# EAGLE design display_e7 (EAGLE 7.7.0)

## Sheet 1 of 8: Atmega8
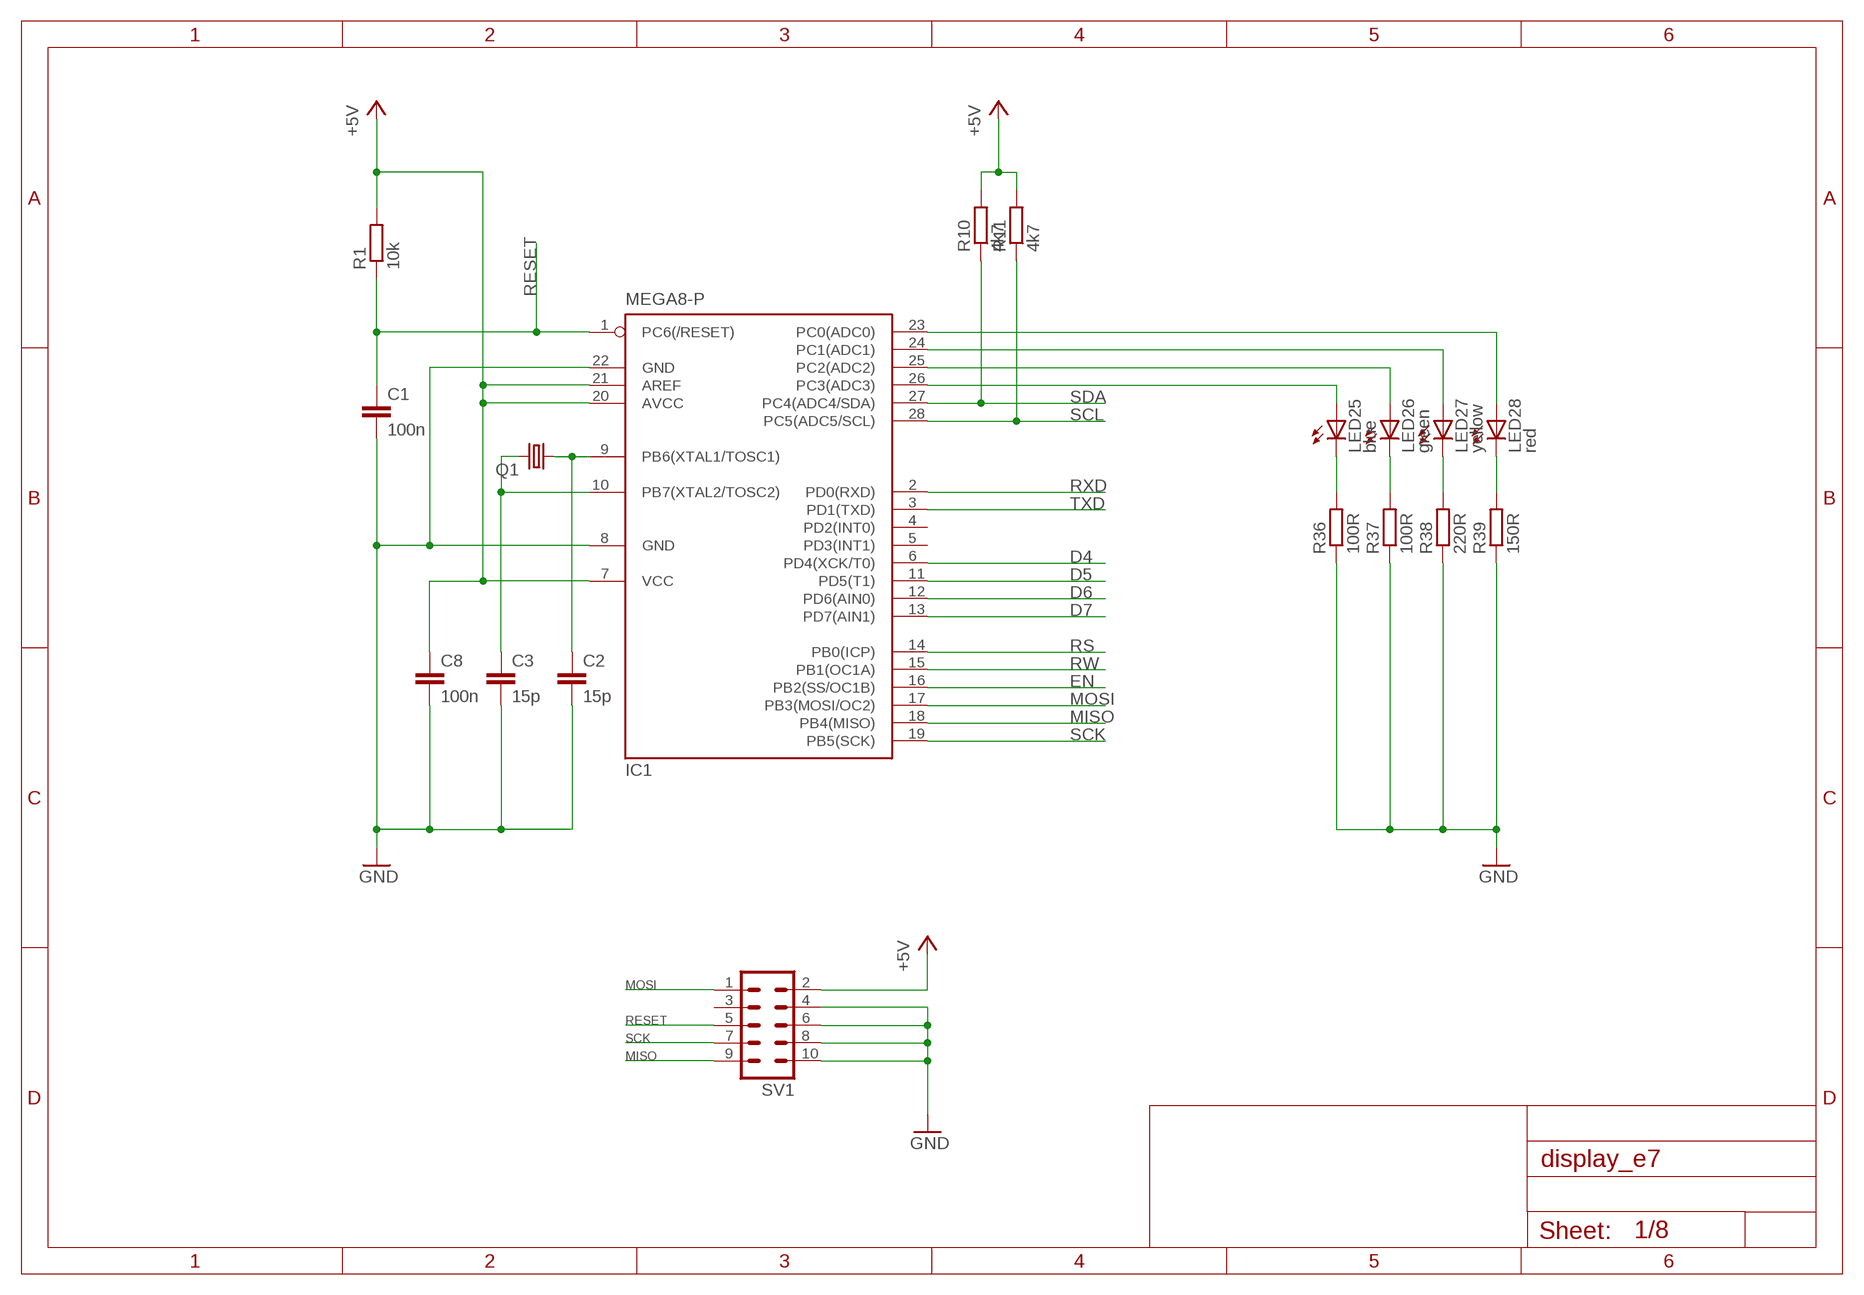
[diagram p0: schematic, sheet 1]

### Parts
C1  100n  C-EU025-025X050  [C025-025X050]
C2  15p  C-EU025-025X050  [C025-025X050]
C3  15p  C-EU025-025X050  [C025-025X050]
C8  100n  C-EU025-025X050  [C025-025X050]
IC1  MEGA8-P  [DIL28-3]
LED25  blue  LED3MM  [LED3MM]
LED26  green  LED3MM  [LED3MM]
LED27  yellow  LED3MM  [LED3MM]
LED28  red  LED3MM  [LED3MM]
Q1  CRYSTALHC49U-V  [HC49U-V]
R1  10k  R-EU_0207/10  [0207/10]
R10  4k7  R-EU_0207/10  [0207/10]
R11  4k7  R-EU_0207/10  [0207/10]
R36  100R  R-EU_0207/10  [0207/10]
R37  100R  R-EU_0207/10  [0207/10]
R38  220R  R-EU_0207/10  [0207/10]
R39  150R  R-EU_0207/10  [0207/10]
SV1  ML10  [ML10]

### Nets
+5V: C8.1 IC1.7(VCC) IC1.20(AVCC) IC1.21(AREF) R1.2 R10.2 R11.2 SV1.2 ; also sheet 2,3,4,5,6,7
D4: IC1.6(PD4(XCK/T0)) ; also sheet 2
D5: IC1.11(PD5(T1)) ; also sheet 2
D6: IC1.12(PD6(AIN0)) ; also sheet 2
D7: IC1.13(PD7(AIN1)) ; also sheet 2
EN: IC1.16(PB2(SS/OC1B)) ; also sheet 2
GND: C1.2 C2.2 C3.2 C8.2 IC1.8(GND) IC1.22(GND) R36.1 R37.1 R38.1 R39.1 SV1.4 SV1.6 SV1.8 SV1.10 ; also sheet 2,3,4,5,6,7
MISO: IC1.18(PB4(MISO)) SV1.9
MOSI: IC1.17(PB3(MOSI/OC2)) SV1.1
N$2: C2.1 IC1.9(PB6(XTAL1/TOSC1)) Q1.1
N$3: C3.1 IC1.10(PB7(XTAL2/TOSC2)) Q1.2
N$40: IC1.23(PC0(ADC0)) LED28.A
N$41: IC1.24(PC1(ADC1)) LED27.A
N$42: IC1.25(PC2(ADC2)) LED26.A
N$43: IC1.26(PC3(ADC3)) LED25.A
N$44: LED28.K(C) R39.2
N$45: LED27.K(C) R38.2
N$46: LED26.K(C) R37.2
N$47: LED25.K(C) R36.2
RESET: C1.1 IC1.1(PC6(/RESET)) R1.1 SV1.5
RS: IC1.14(PB0(ICP)) ; also sheet 2
RW: IC1.15(PB1(OC1A)) ; also sheet 2
RXD: IC1.2(PD0(RXD)) ; also sheet 4
SCK: IC1.19(PB5(SCK)) SV1.7
SCL: IC1.28(PC5(ADC5/SCL)) R11.1 ; also sheet 7
SDA: IC1.27(PC4(ADC4/SDA)) R10.1 ; also sheet 7
TXD: IC1.3(PD1(TXD)) ; also sheet 4
Unconnected: IC1.4(PD2(INT0)) IC1.5(PD3(INT1)) SV1.3

## Sheet 2 of 8: Display
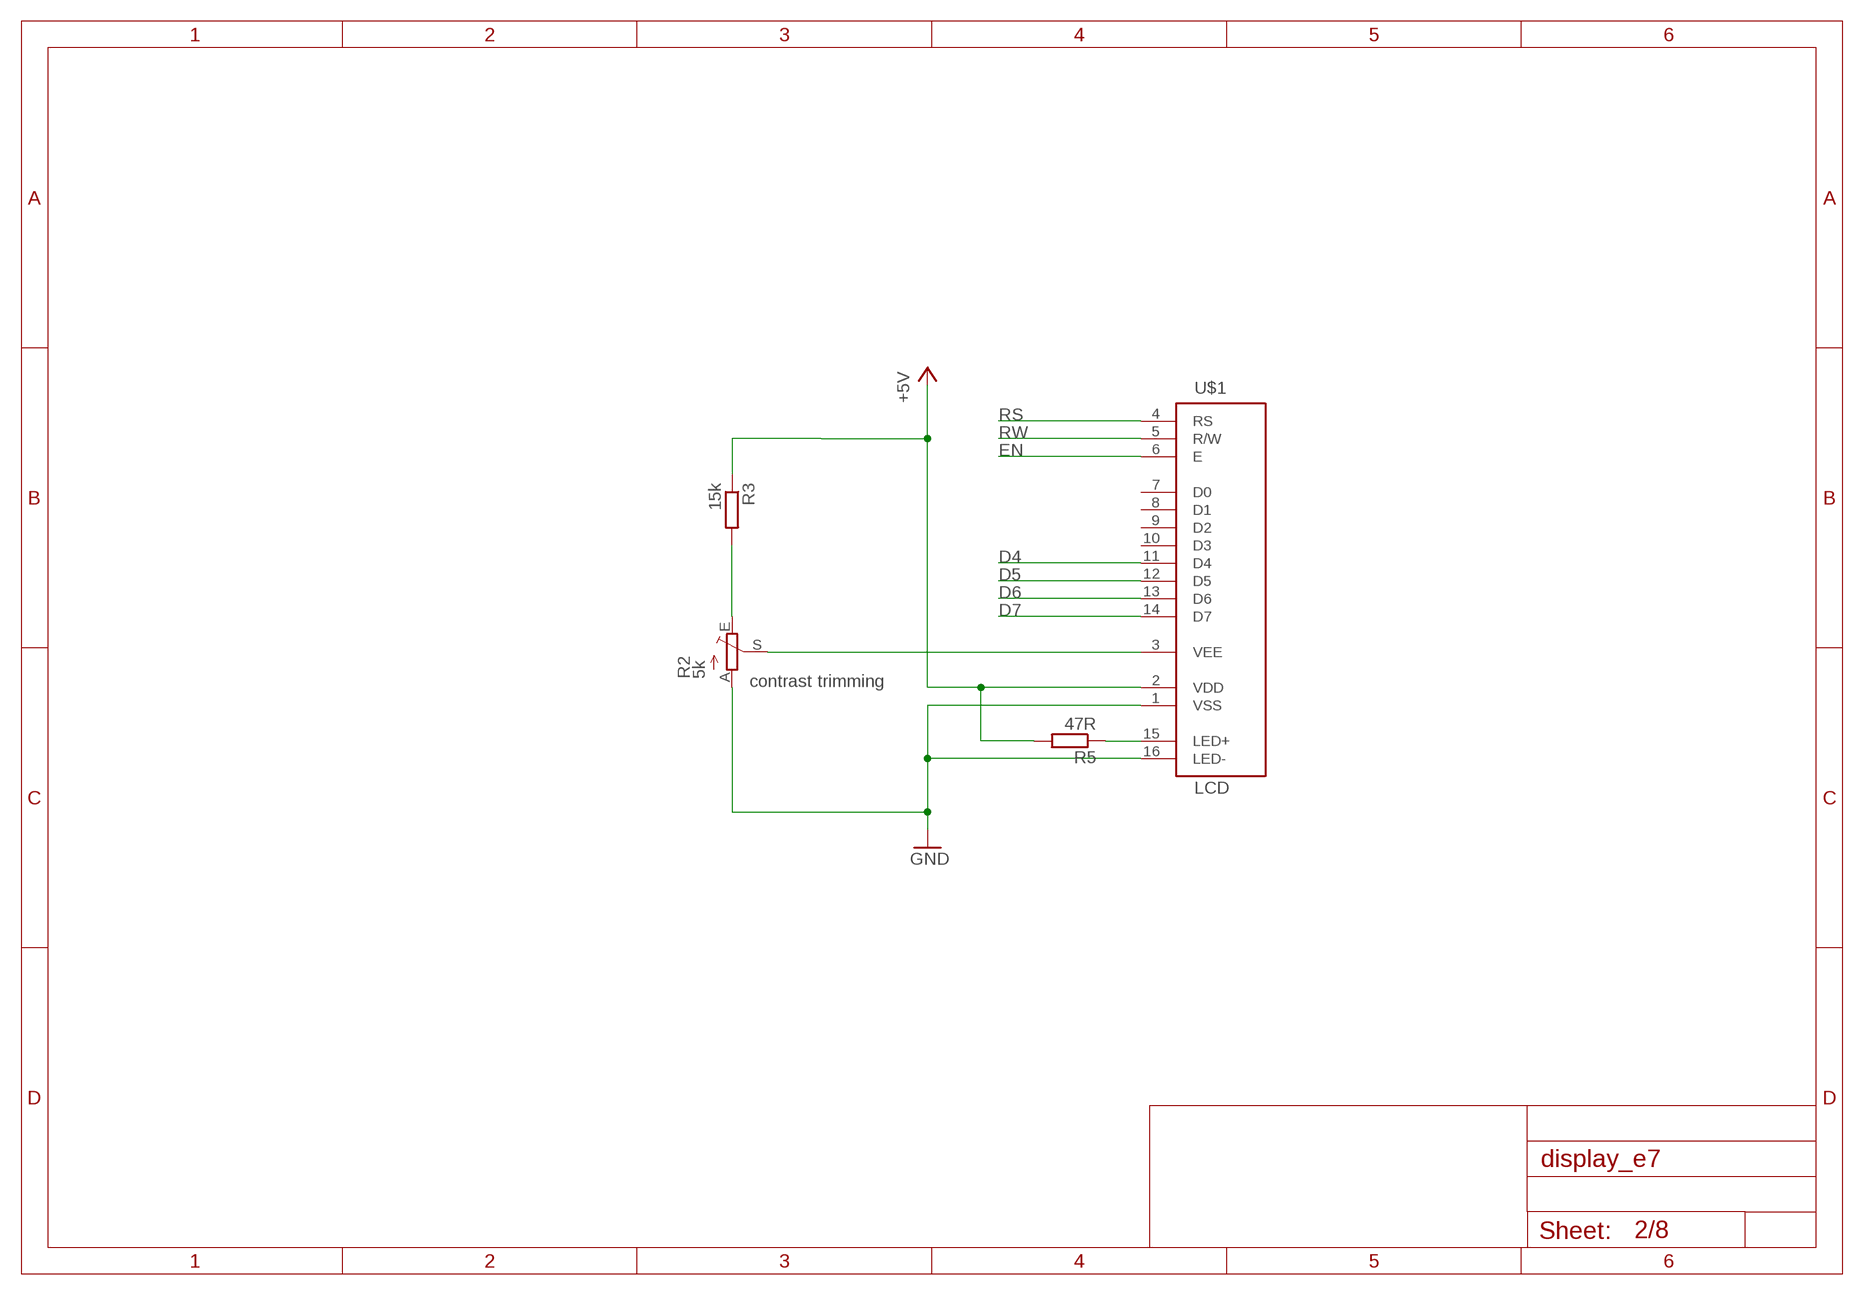
[diagram p1: schematic, sheet 2]

### Parts
R2  5k  TRIM_EU-PT10  [PT-10]
R3  15k  R-EU_0207/10  [0207/10]
R5  47R  R-EU_0207/10  [0207/10]
U$1  LCD  [LCD]

### Nets
+5V: R3.1 R5.2 U$1.2(VDD) ; also sheet 1,3,4,5,6,7
D4: U$1.11(D4) ; also sheet 1
D5: U$1.12(D5) ; also sheet 1
D6: U$1.13(D6) ; also sheet 1
D7: U$1.14(D7) ; also sheet 1
EN: U$1.6(E) ; also sheet 1
GND: R2.A U$1.1(VSS) U$1.16(LED-) ; also sheet 1,3,4,5,6,7
N$9: R2.E R3.2
N$10: R2.S U$1.3(VEE)
N$11: R5.1 U$1.15(LED+)
RS: U$1.4(RS) ; also sheet 1
RW: U$1.5(R/W) ; also sheet 1
Unconnected: U$1.7(D0) U$1.8(D1) U$1.9(D2) U$1.10(D3)

### Notes on the sheet
- contrast trimming

## Sheet 3 of 8: Connectors
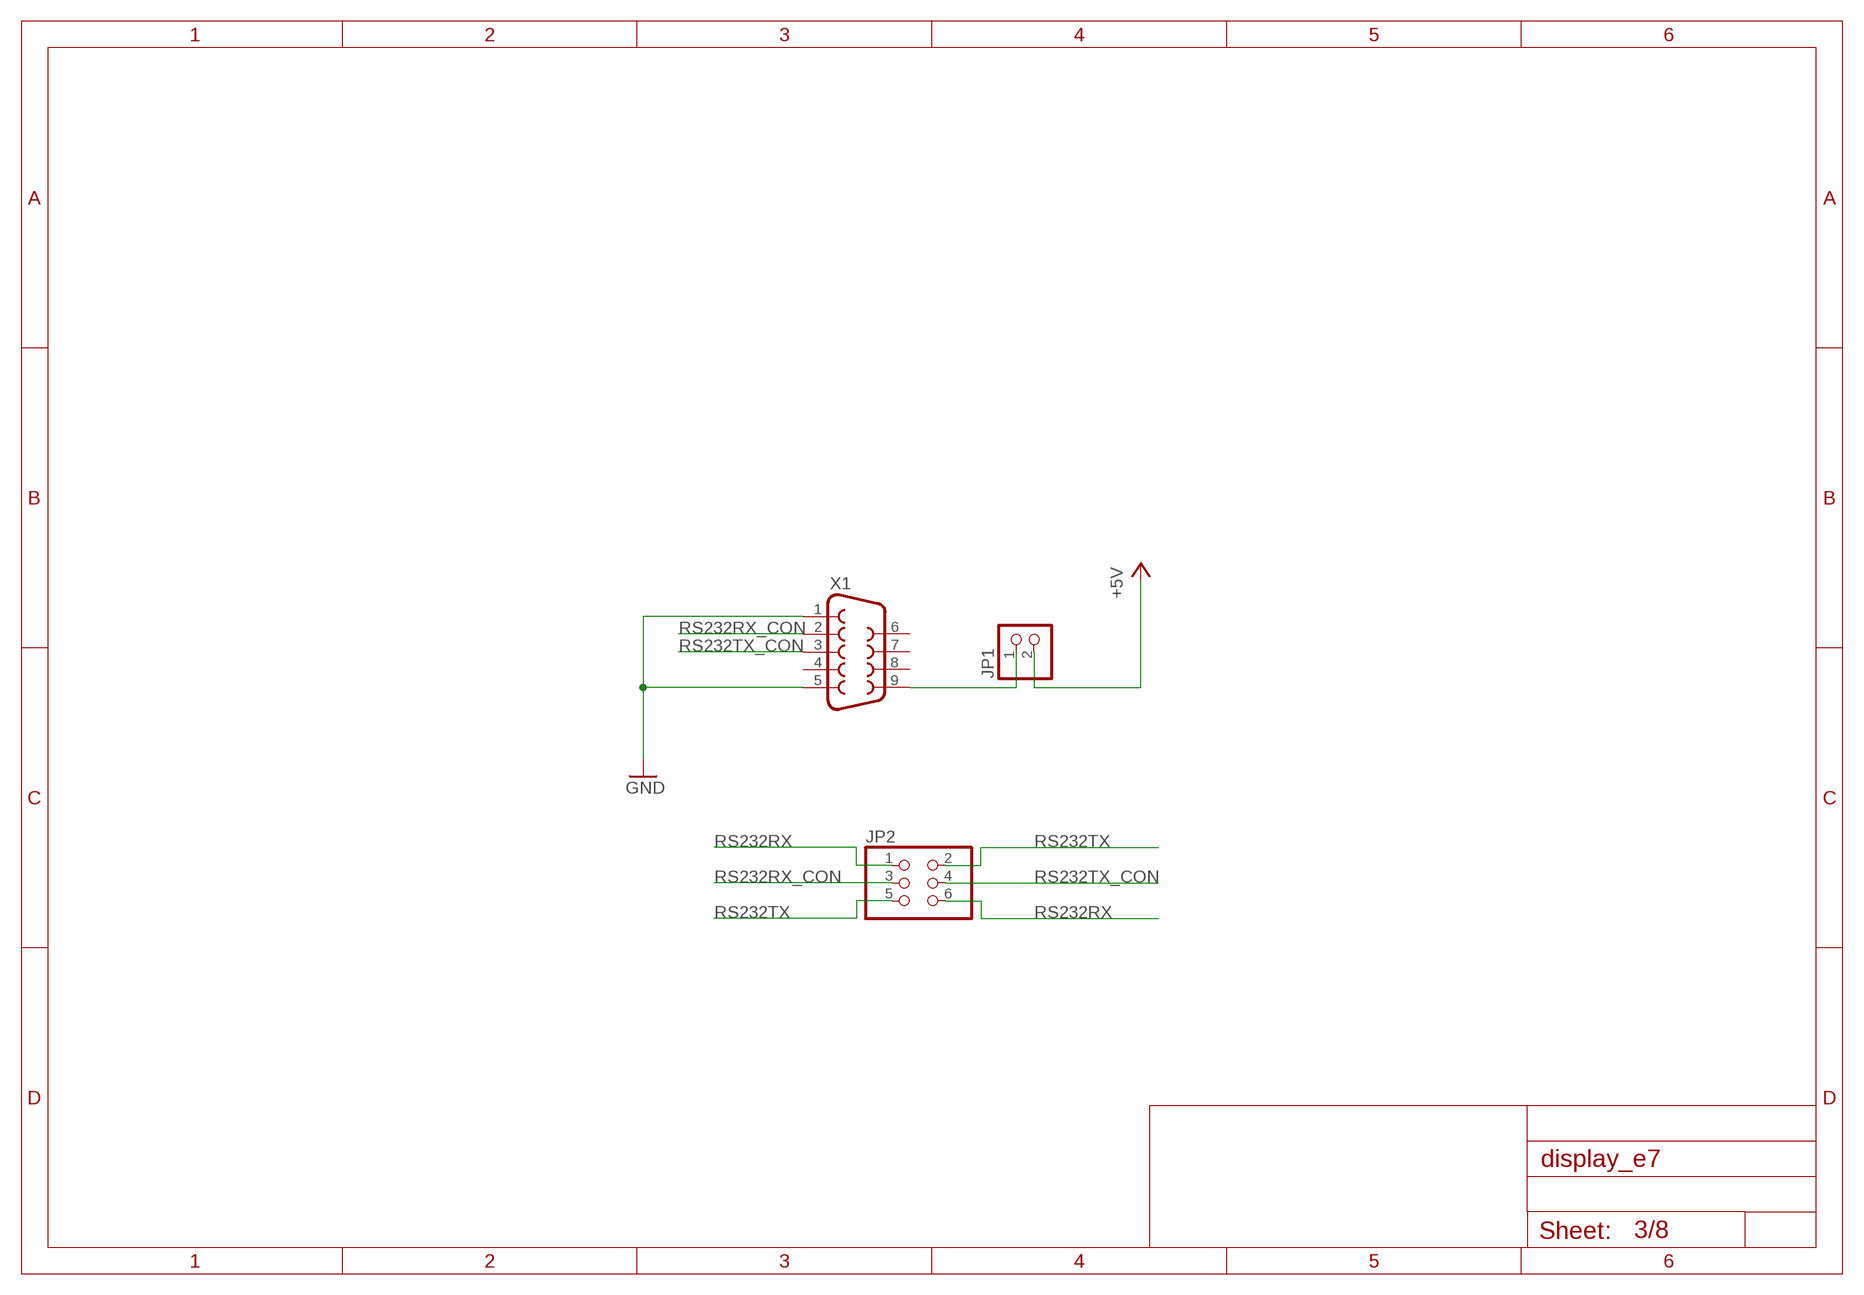
[diagram p2: schematic, sheet 3]

### Parts
JP1  PINHD-1X2  [1X02]
JP2  PINHD-2X3  [2X03]
X1  F09HP  [F09HP]

### Nets
+5V: JP1.2 ; also sheet 1,2,4,5,6,7
GND: X1.1 X1.5 ; also sheet 1,2,4,5,6,7
N$48: JP1.1 X1.9
RS232RX: JP2.1 JP2.6 ; also sheet 4
RS232RX_CON: JP2.3 X1.2
RS232TX: JP2.2 JP2.5 ; also sheet 4
RS232TX_CON: JP2.4 X1.3
Unconnected: X1.4 X1.6 X1.7 X1.8

## Sheet 4 of 8: RS232
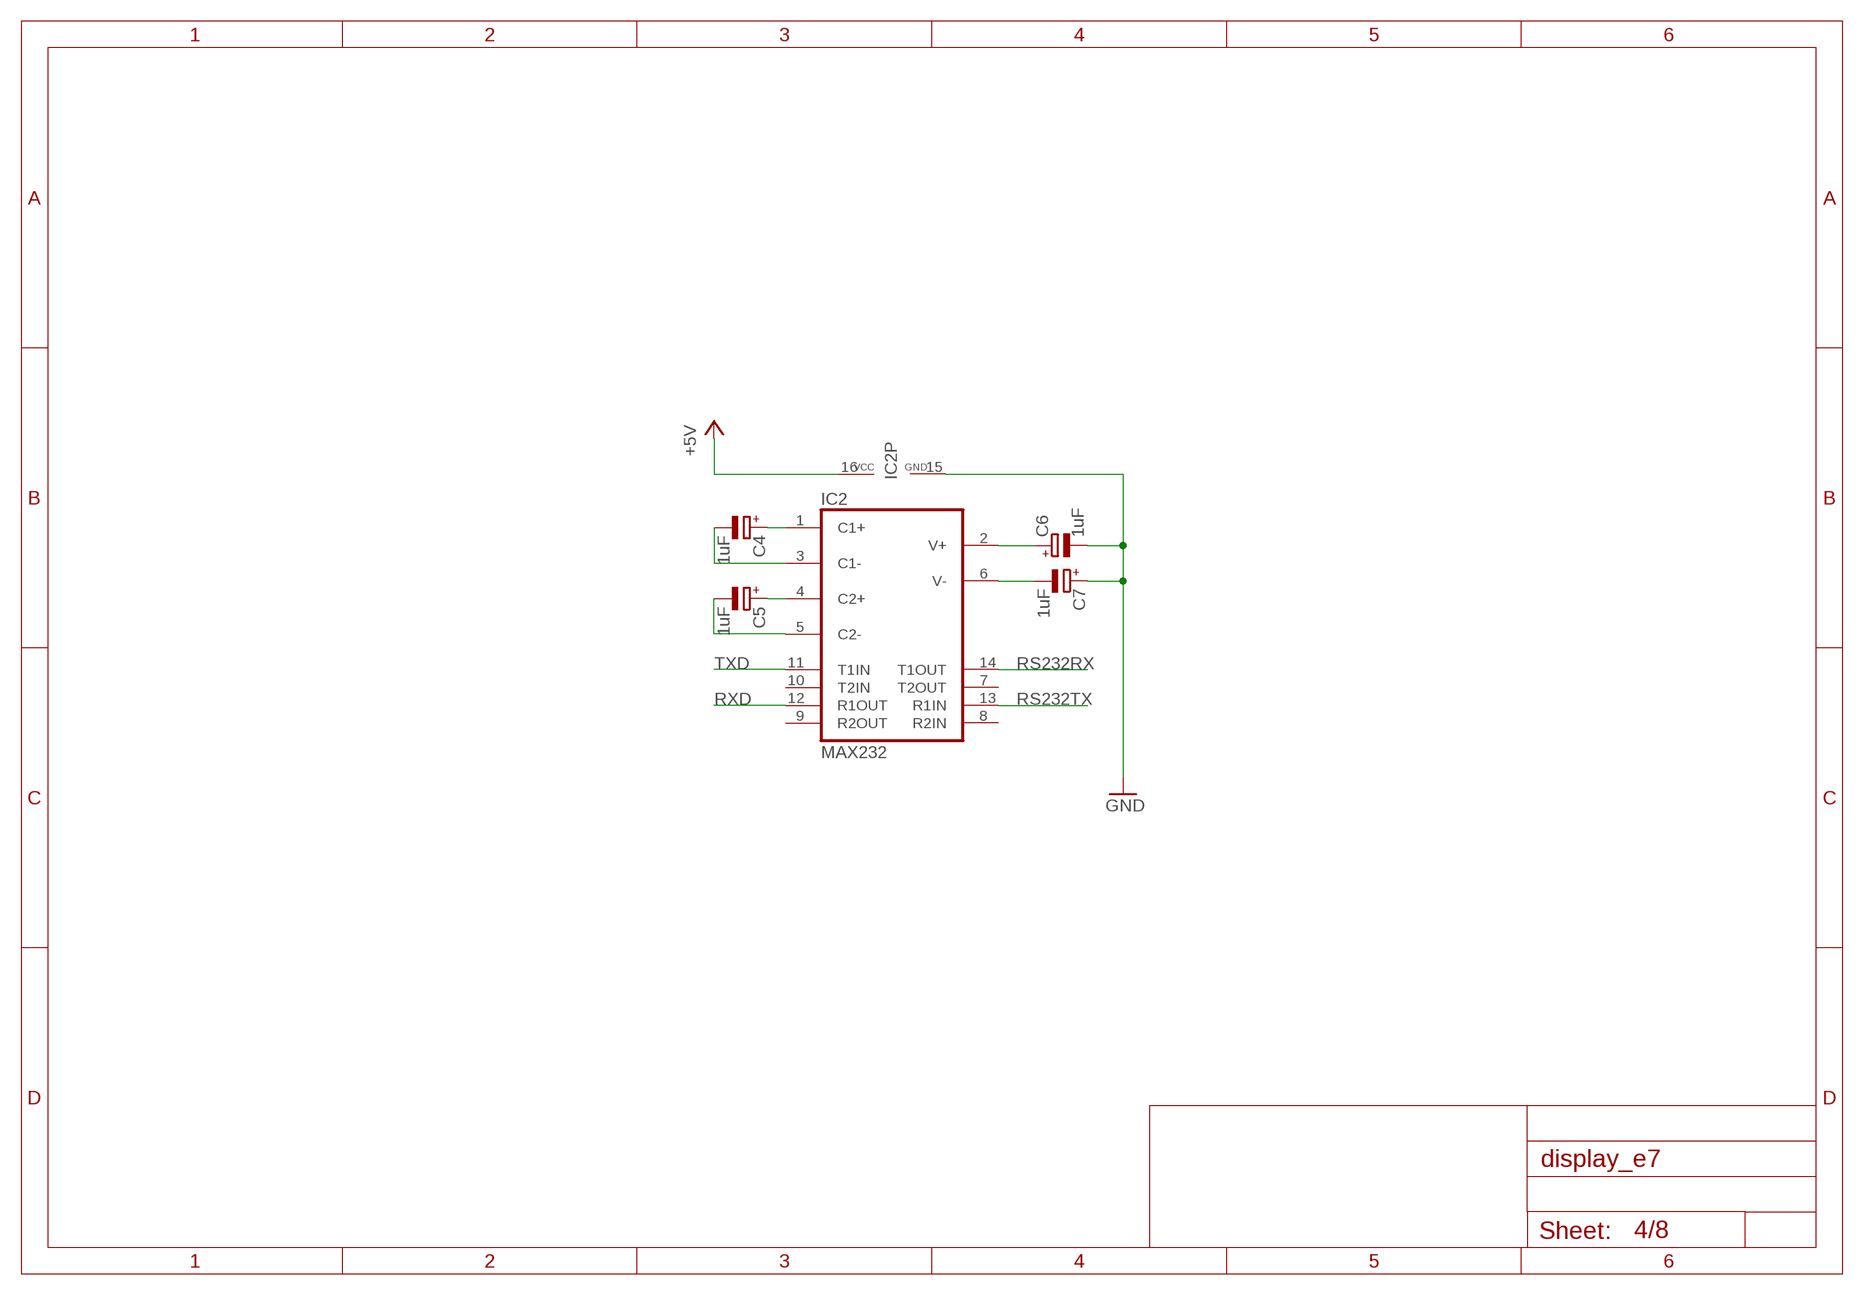
[diagram p3: schematic, sheet 4]

### Parts
C4  1uF  CPOL-EUE2.5-5  [E2,5-5]
C5  1uF  CPOL-EUE2.5-5  [E2,5-5]
C6  1uF  CPOL-EUE2.5-5  [E2,5-5]
C7  1uF  CPOL-EUE2.5-5  [E2,5-5]
IC2  MAX232  [DIL16]

### Nets
+5V: IC2.16(VCC) ; also sheet 1,2,3,5,6,7
GND: C6.- C7.+ IC2.15(GND) ; also sheet 1,2,3,5,6,7
N$1: C4.+ IC2.1(C1+)
N$4: C5.+ IC2.4(C2+)
N$5: C5.- IC2.5(C2-)
N$6: C4.- IC2.3(C1-)
N$7: C6.+ IC2.2(V+)
N$8: C7.- IC2.6(V-)
RS232RX: IC2.14(T1OUT) ; also sheet 3
RS232TX: IC2.13(R1IN) ; also sheet 3
RXD: IC2.12(R1OUT) ; also sheet 1
TXD: IC2.11(T1IN) ; also sheet 1
Unconnected: IC2.7(T2OUT) IC2.8(R2IN) IC2.9(R2OUT) IC2.10(T2IN)

## Sheet 5 of 8: LED Bar
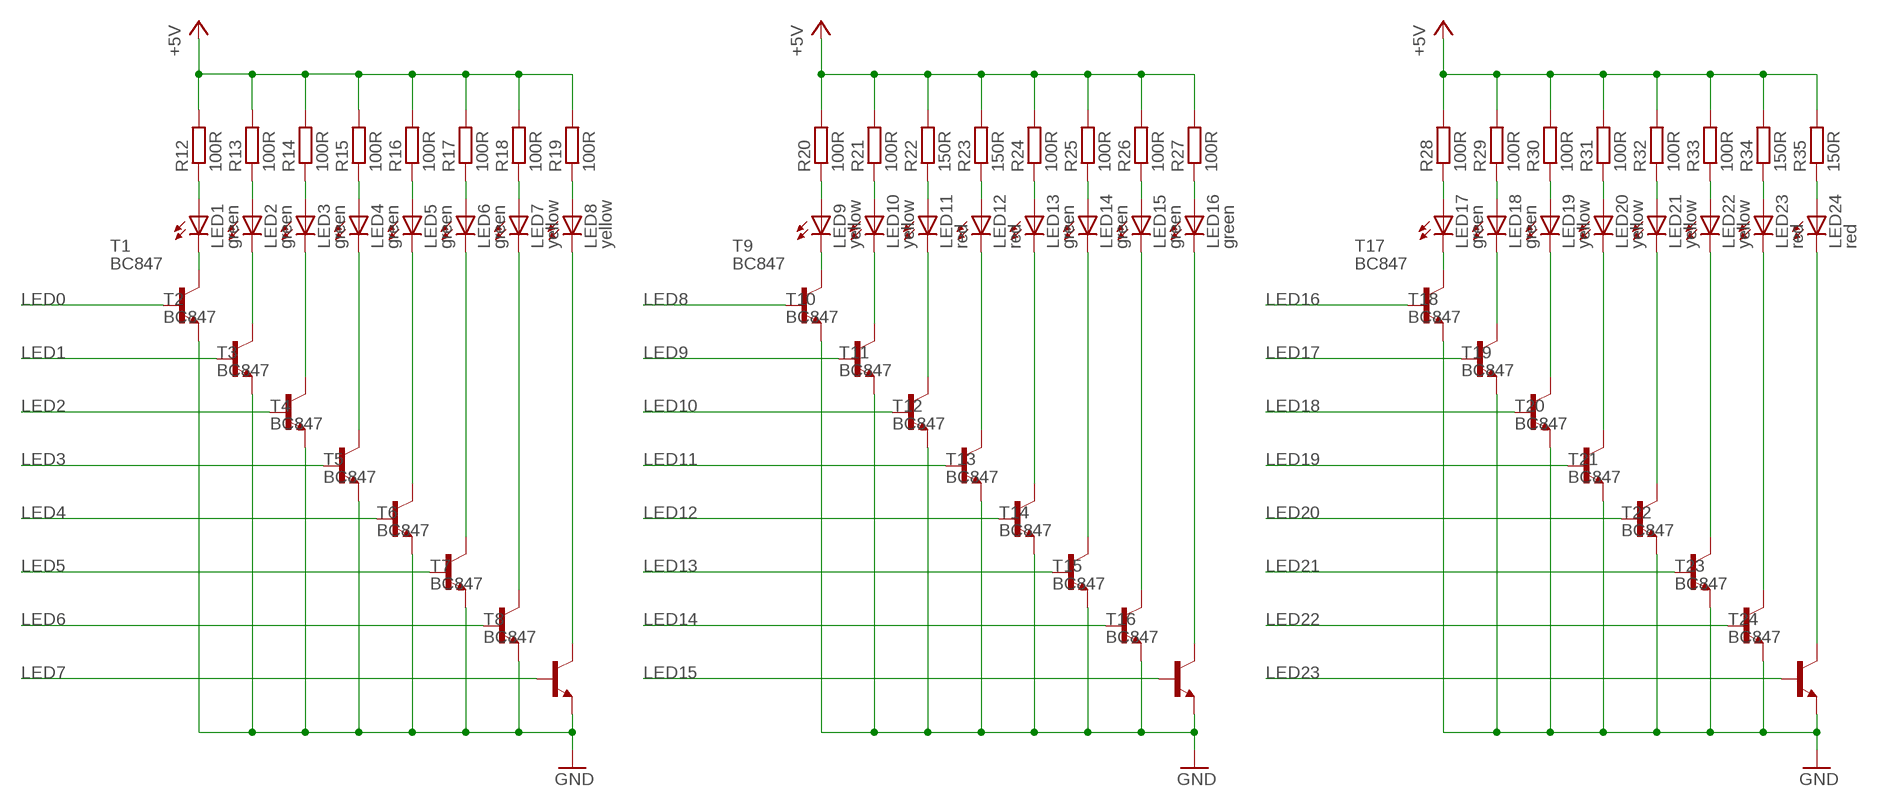
[diagram p4: schematic, sheet 5]

### Parts
LED1  green  LED5MM  [LED5MM]
LED2  green  LED5MM  [LED5MM]
LED3  green  LED5MM  [LED5MM]
LED4  green  LED5MM  [LED5MM]
LED5  green  LED5MM  [LED5MM]
LED6  green  LED5MM  [LED5MM]
LED7  yellow  LED5MM  [LED5MM]
LED8  yellow  LED5MM  [LED5MM]
LED9  yellow  LED5MM  [LED5MM]
LED10  yellow  LED5MM  [LED5MM]
LED11  red  LED5MM  [LED5MM]
LED12  red  LED5MM  [LED5MM]
LED13  green  LED5MM  [LED5MM]
LED14  green  LED5MM  [LED5MM]
LED15  green  LED5MM  [LED5MM]
LED16  green  LED5MM  [LED5MM]
LED17  green  LED5MM  [LED5MM]
LED18  green  LED5MM  [LED5MM]
LED19  yellow  LED5MM  [LED5MM]
LED20  yellow  LED5MM  [LED5MM]
LED21  yellow  LED5MM  [LED5MM]
LED22  yellow  LED5MM  [LED5MM]
LED23  red  LED5MM  [LED5MM]
LED24  red  LED5MM  [LED5MM]
R12  100R  R-EU_0207/10  [0207/10]
R13  100R  R-EU_0207/10  [0207/10]
R14  100R  R-EU_0207/10  [0207/10]
R15  100R  R-EU_0207/10  [0207/10]
R16  100R  R-EU_0207/10  [0207/10]
R17  100R  R-EU_0207/10  [0207/10]
R18  100R  R-EU_0207/10  [0207/10]
R19  100R  R-EU_0207/10  [0207/10]
R20  100R  R-EU_0207/10  [0207/10]
R21  100R  R-EU_0207/10  [0207/10]
R22  150R  R-EU_0207/10  [0207/10]
R23  150R  R-EU_0207/10  [0207/10]
R24  100R  R-EU_0207/10  [0207/10]
R25  100R  R-EU_0207/10  [0207/10]
R26  100R  R-EU_0207/10  [0207/10]
R27  100R  R-EU_0207/10  [0207/10]
R28  100R  R-EU_0207/10  [0207/10]
R29  100R  R-EU_0207/10  [0207/10]
R30  100R  R-EU_0207/10  [0207/10]
R31  100R  R-EU_0207/10  [0207/10]
R32  100R  R-EU_0207/10  [0207/10]
R33  100R  R-EU_0207/10  [0207/10]
R34  150R  R-EU_0207/10  [0207/10]
R35  150R  R-EU_0207/10  [0207/10]
T1  BC847  [SOT23]
T2  BC847  [SOT23]
T3  BC847  [SOT23]
T4  BC847  [SOT23]
T5  BC847  [SOT23]
T6  BC847  [SOT23]
T7  BC847  [SOT23]
T8  BC847  [SOT23]
T9  BC847  [SOT23]
T10  BC847  [SOT23]
T11  BC847  [SOT23]
T12  BC847  [SOT23]
T13  BC847  [SOT23]
T14  BC847  [SOT23]
T15  BC847  [SOT23]
T16  BC847  [SOT23]
T17  BC847  [SOT23]
T18  BC847  [SOT23]
T19  BC847  [SOT23]
T20  BC847  [SOT23]
T21  BC847  [SOT23]
T22  BC847  [SOT23]
T23  BC847  [SOT23]
T24  BC847  [SOT23]

### Nets
+5V: R12.2 R13.2 R14.2 R15.2 R16.2 R17.2 R18.2 R19.2 R20.2 R21.2 R22.2 R23.2 R24.2 R25.2 R26.2 R27.2 R28.2 R29.2 R30.2 R31.2 R32.2 R33.2 R34.2 R35.2 ; also sheet 1,2,3,4,6,7
GND: T1.2(E) T2.2(E) T3.2(E) T4.2(E) T5.2(E) T6.2(E) T7.2(E) T8.2(E) T9.2(E) T10.2(E) T11.2(E) T12.2(E) T13.2(E) T14.2(E) T15.2(E) T16.2(E) T17.2(E) T18.2(E) T19.2(E) T20.2(E) T21.2(E) T22.2(E) T23.2(E) T24.2(E) ; also sheet 1,2,3,4,6,7
LED0: T1.1(B) ; also sheet 7
LED1: T2.1(B) ; also sheet 7
LED2: T3.1(B) ; also sheet 7
LED3: T4.1(B) ; also sheet 7
LED4: T5.1(B) ; also sheet 7
LED5: T6.1(B) ; also sheet 7
LED6: T7.1(B) ; also sheet 7
LED7: T8.1(B) ; also sheet 7
LED8: T9.1(B) ; also sheet 7
LED9: T10.1(B) ; also sheet 7
LED10: T11.1(B) ; also sheet 7
LED11: T12.1(B) ; also sheet 7
LED12: T13.1(B) ; also sheet 7
LED13: T14.1(B) ; also sheet 7
LED14: T15.1(B) ; also sheet 7
LED15: T16.1(B) ; also sheet 7
LED16: T17.1(B) ; also sheet 7
LED17: T18.1(B) ; also sheet 7
LED18: T19.1(B) ; also sheet 7
LED19: T20.1(B) ; also sheet 7
LED20: T21.1(B) ; also sheet 7
LED21: T22.1(B) ; also sheet 7
LED22: T23.1(B) ; also sheet 7
LED23: T24.1(B) ; also sheet 7
N$15: LED1.A R12.1
N$17: LED2.A R13.1
N$18: LED3.A R14.1
N$19: LED4.A R15.1
N$20: LED5.A R16.1
N$21: LED6.A R17.1
N$22: LED7.A R18.1
N$23: LED8.A R19.1
N$24: LED9.A R20.1
N$25: LED10.A R21.1
N$26: LED11.A R22.1
N$27: LED12.A R23.1
N$28: LED13.A R24.1
N$29: LED14.A R25.1
N$30: LED15.A R26.1
N$31: LED16.A R27.1
N$32: LED17.A R28.1
N$33: LED18.A R29.1
N$34: LED19.A R30.1
N$35: LED20.A R31.1
N$36: LED21.A R32.1
N$37: LED22.A R33.1
N$38: LED23.A R34.1
N$39: LED24.A R35.1
N$51: LED9.K(C) T9.3(C)
N$53: LED1.K(C) T1.3(C)
N$54: LED2.K(C) T2.3(C)
N$55: LED3.K(C) T3.3(C)
N$56: LED4.K(C) T4.3(C)
N$57: LED5.K(C) T5.3(C)
N$58: LED6.K(C) T6.3(C)
N$59: LED17.K(C) T17.3(C)
N$60: LED10.K(C) T10.3(C)
N$61: LED11.K(C) T11.3(C)
N$62: LED12.K(C) T12.3(C)
N$63: LED13.K(C) T13.3(C)
N$64: LED14.K(C) T14.3(C)
N$65: LED7.K(C) T7.3(C)
N$66: LED8.K(C) T8.3(C)
N$67: LED15.K(C) T15.3(C)
N$68: LED16.K(C) T16.3(C)
N$69: LED18.K(C) T18.3(C)
N$70: LED19.K(C) T19.3(C)
N$71: LED20.K(C) T20.3(C)
N$72: LED21.K(C) T21.3(C)
N$73: LED22.K(C) T22.3(C)
N$74: LED23.K(C) T23.3(C)
N$75: LED24.K(C) T24.3(C)

## Sheet 6 of 8: Buttons
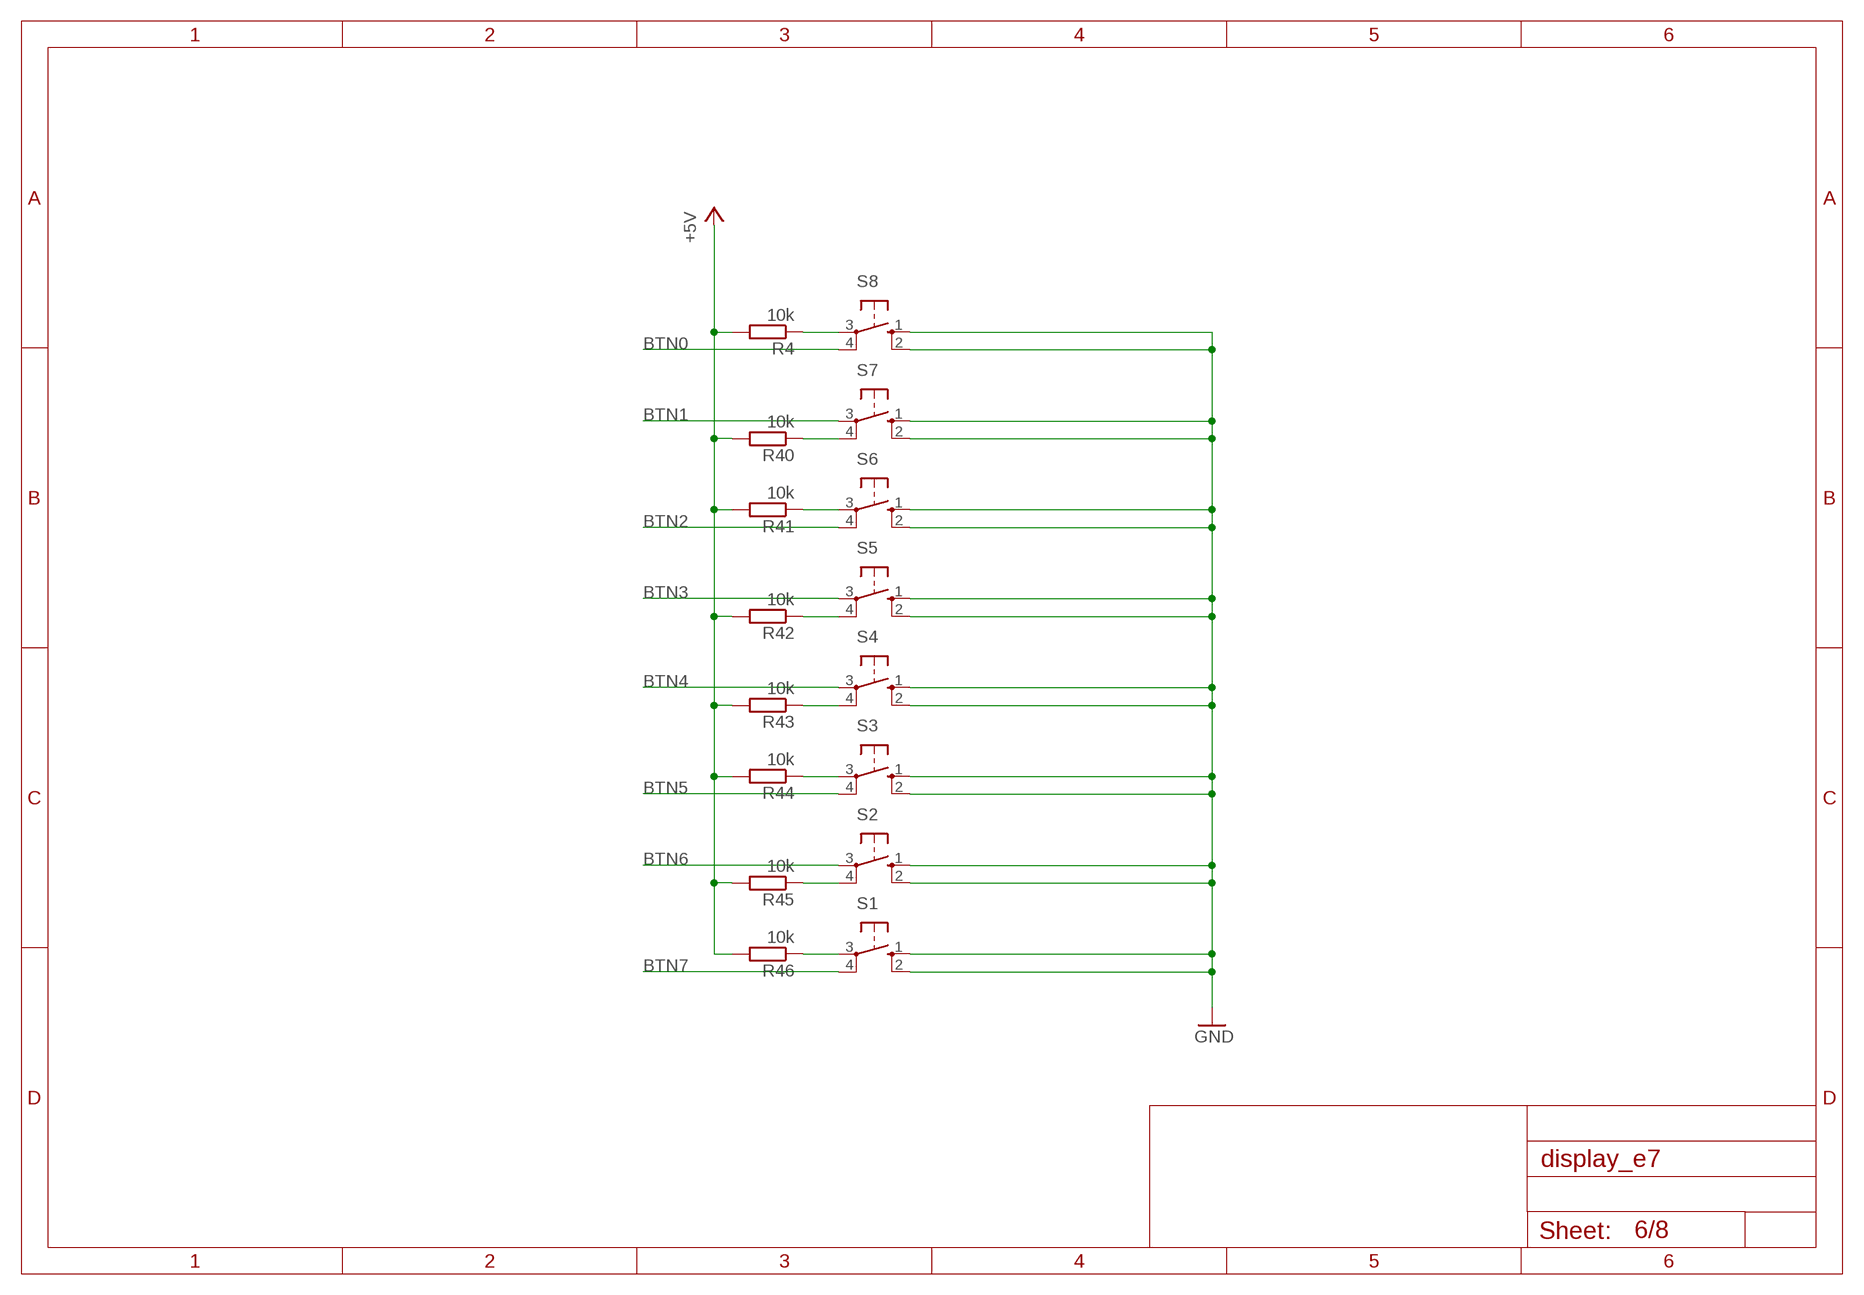
[diagram p5: schematic, sheet 6]

### Parts
R4  10k  R-EU_R0805  [R0805]
R40  10k  R-EU_R0805  [R0805]
R41  10k  R-EU_R0805  [R0805]
R42  10k  R-EU_R0805  [R0805]
R43  10k  R-EU_R0805  [R0805]
R44  10k  R-EU_R0805  [R0805]
R45  10k  R-EU_R0805  [R0805]
R46  10k  R-EU_R0805  [R0805]
S1  10-XX  [B3F-10XX]
S2  10-XX  [B3F-10XX]
S3  10-XX  [B3F-10XX]
S4  10-XX  [B3F-10XX]
S5  10-XX  [B3F-10XX]
S6  10-XX  [B3F-10XX]
S7  10-XX  [B3F-10XX]
S8  10-XX  [B3F-10XX]

### Nets
+5V: R4.2 R40.2 R41.2 R42.2 R43.2 R44.2 R45.2 R46.2 ; also sheet 1,2,3,4,5,7
BTN0: S8.4(P1) ; also sheet 7
BTN1: S7.3(P) ; also sheet 7
BTN2: S6.4(P1) ; also sheet 7
BTN3: S5.3(P) ; also sheet 7
BTN4: S4.3(P) ; also sheet 7
BTN5: S3.4(P1) ; also sheet 7
BTN6: S2.3(P) ; also sheet 7
BTN7: S1.4(P1) ; also sheet 7
GND: S1.1(S) S1.2(S1) S2.1(S) S2.2(S1) S3.1(S) S3.2(S1) S4.1(S) S4.2(S1) S5.1(S) S5.2(S1) S6.1(S) S6.2(S1) S7.1(S) S7.2(S1) S8.1(S) S8.2(S1) ; also sheet 1,2,3,4,5,7
N$49: R4.1 S8.3(P)
N$50: R41.1 S6.3(P)
N$52: R45.1 S2.4(P1)
N$76: R43.1 S4.4(P1)
N$77: R44.1 S3.3(P)
N$78: R42.1 S5.4(P1)
N$79: R46.1 S1.3(P)
N$80: R40.1 S7.4(P1)

## Sheet 7 of 8: IO Expander
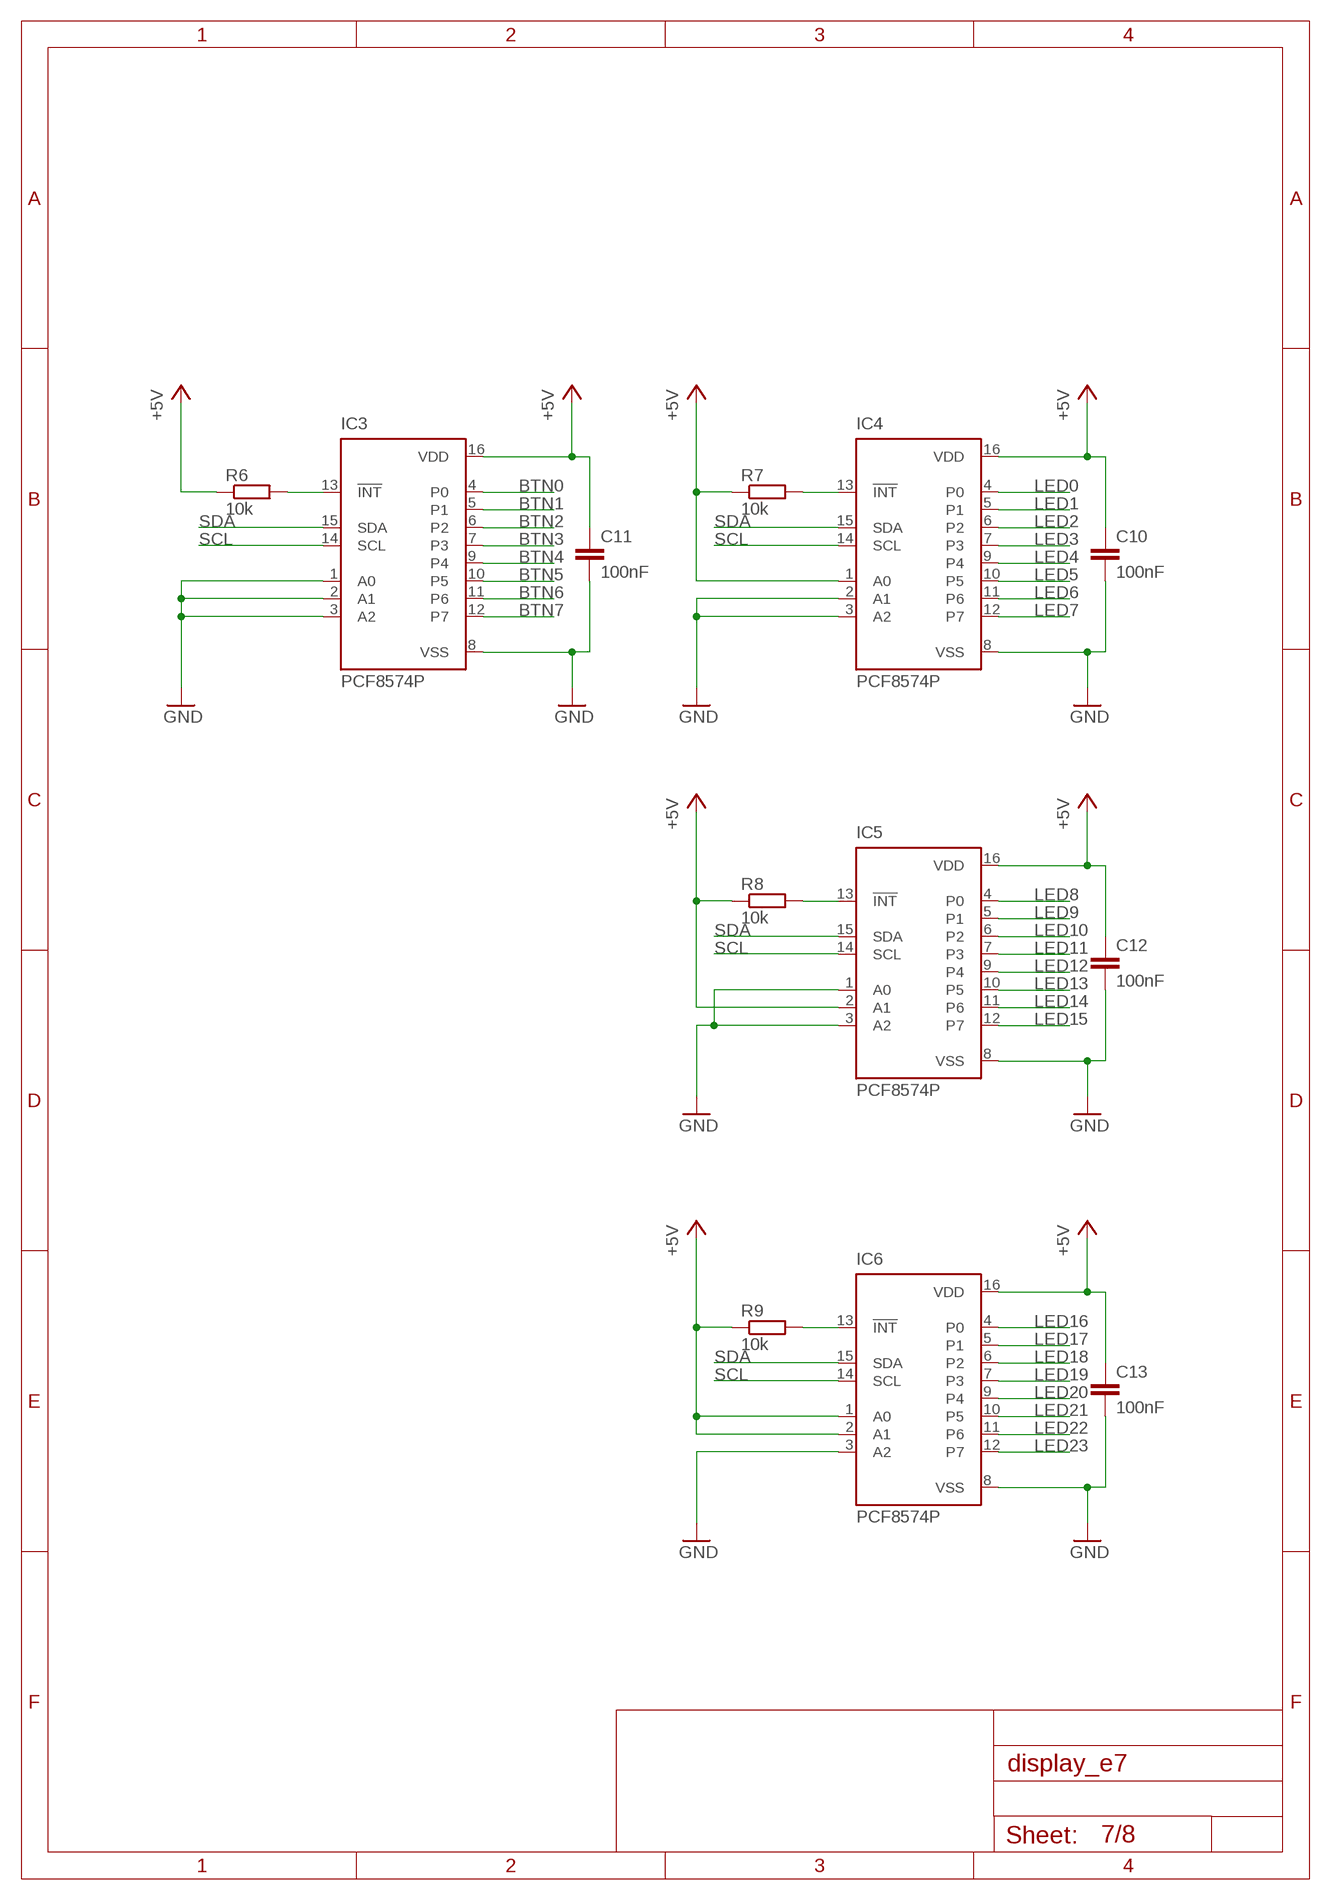
[diagram p6: schematic, sheet 7]

### Parts
C10  100nF  C-EU025-025X050  [C025-025X050]
C11  100nF  C-EU025-025X050  [C025-025X050]
C12  100nF  C-EU025-025X050  [C025-025X050]
C13  100nF  C-EU025-025X050  [C025-025X050]
IC3  PCF8574P  [DIL16]
IC4  PCF8574P  [DIL16]
IC5  PCF8574P  [DIL16]
IC6  PCF8574P  [DIL16]
R6  10k  R-EU_0207/10  [0207/10]
R7  10k  R-EU_0207/10  [0207/10]
R8  10k  R-EU_0207/10  [0207/10]
R9  10k  R-EU_0207/10  [0207/10]

### Nets
+5V: C10.1 C11.1 C12.1 C13.1 IC3.16(VDD) IC4.1(A0) IC4.16(VDD) IC5.2(A1) IC5.16(VDD) IC6.1(A0) IC6.2(A1) IC6.16(VDD) R6.1 R7.1 R8.1 R9.1 ; also sheet 1,2,3,4,5,6
BTN0: IC3.4(P0) ; also sheet 6
BTN1: IC3.5(P1) ; also sheet 6
BTN2: IC3.6(P2) ; also sheet 6
BTN3: IC3.7(P3) ; also sheet 6
BTN4: IC3.9(P4) ; also sheet 6
BTN5: IC3.10(P5) ; also sheet 6
BTN6: IC3.11(P6) ; also sheet 6
BTN7: IC3.12(P7) ; also sheet 6
GND: C10.2 C11.2 C12.2 C13.2 IC3.1(A0) IC3.2(A1) IC3.3(A2) IC3.8(VSS) IC4.2(A1) IC4.3(A2) IC4.8(VSS) IC5.1(A0) IC5.3(A2) IC5.8(VSS) IC6.3(A2) IC6.8(VSS) ; also sheet 1,2,3,4,5,6
LED0: IC4.4(P0) ; also sheet 5
LED1: IC4.5(P1) ; also sheet 5
LED2: IC4.6(P2) ; also sheet 5
LED3: IC4.7(P3) ; also sheet 5
LED4: IC4.9(P4) ; also sheet 5
LED5: IC4.10(P5) ; also sheet 5
LED6: IC4.11(P6) ; also sheet 5
LED7: IC4.12(P7) ; also sheet 5
LED8: IC5.4(P0) ; also sheet 5
LED9: IC5.5(P1) ; also sheet 5
LED10: IC5.6(P2) ; also sheet 5
LED11: IC5.7(P3) ; also sheet 5
LED12: IC5.9(P4) ; also sheet 5
LED13: IC5.10(P5) ; also sheet 5
LED14: IC5.11(P6) ; also sheet 5
LED15: IC5.12(P7) ; also sheet 5
LED16: IC6.4(P0) ; also sheet 5
LED17: IC6.5(P1) ; also sheet 5
LED18: IC6.6(P2) ; also sheet 5
LED19: IC6.7(P3) ; also sheet 5
LED20: IC6.9(P4) ; also sheet 5
LED21: IC6.10(P5) ; also sheet 5
LED22: IC6.11(P6) ; also sheet 5
LED23: IC6.12(P7) ; also sheet 5
N$12: IC3.13(!INT) R6.2
N$13: IC4.13(!INT) R7.2
N$14: IC5.13(!INT) R8.2
N$16: IC6.13(!INT) R9.2
SCL: IC3.14(SCL) IC4.14(SCL) IC5.14(SCL) IC6.14(SCL) ; also sheet 1
SDA: IC3.15(SDA) IC4.15(SDA) IC5.15(SDA) IC6.15(SDA) ; also sheet 1

## Sheet 8 of 8: PCB Dimensions
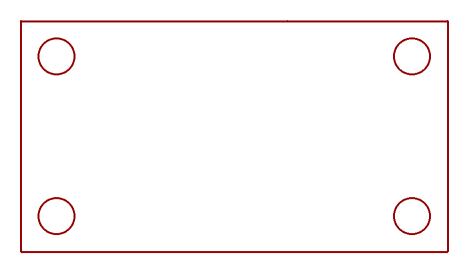
[diagram p7: schematic, sheet 8]

### Parts
U$2  DISPLAY_FRAME  [DISPLAY_FRAME]

## Library data of the parts
C1-C3 C8 C10-C13 = rcl:C-EU: CAPACITOR, European symbol; SPICEPREFIX: C
C4-C7 = rcl:CPOL-EU: POLARIZED CAPACITOR, European symbol; SPICEPREFIX: C
IC1 = atmel:MEGA8-P: MICROCONTROLLER 8 Kbytes FLASH, 1 kbytes SRAM, 512 bytes EEPROM, USART, 4-channel 10 bit ADC, 2-channel 8 bit ADC Pin compatible with Atmega48, ATMega88, ATMega168 Source: avr.lbr; OC_FARNELL: unknown; OC_NEWARK: unknown
IC2 = maxim:MAX232: RS232 TRANSCEIVER; MF: MAXIM; MPN: MAX232ACPE+; OC_FARNELL: 9723773; OC_NEWARK: 68K4544
IC3-IC6 = micro-philips:PCF8574: I2C-Bus Remote 8-bit I/O expander http://www.semiconductors.philips.com/acrobat_download/datasheets/PCF8574_4.pdf; MPN: PCF8574PN; OC_FARNELL: 204020; OC_NEWARK: 11N8515
JP1 = pinhead:PINHD-1X2: PIN HEADER
JP2 = pinhead:PINHD-2X3: PIN HEADER
LED1-LED16 LED25-LED28 = led:LED: LED OSRAM: - CHIPLED LG R971, LG N971, LY N971, LG Q971, LY Q971, LO R971, LY R971 LH N974, LH R974 LS Q976, LO Q976, LY Q976 LO Q996 - Hyper CHIPLED LW Q18S LB Q993, LB Q99A, LB R99A - SideLED LS A670, LO A670, LY A670, LG A670, LP A670 LB A673, LV A673, LT A673, LW A673 LH A674 LY A675 LS A676, LA A676, LO A676, LY A676, LW A676 LS A679, LY A679, LG A679 - Hyper Micro SIDELED® LS Y876, LA Y876, LO Y876, LY Y876 LT Y87S - SmartLED LW L88C, LW L88S LB L89C, LB L89S, LG L890 LS L89K, LO L89K, LY L89K LS L896, LA L896, LO L896, LY L896 - TOPLED LS T670, LO T670, LY T670, LG T670, LP T670 LSG T670, LSP T670, LSY T670, LOP T670, LYG T670 LG T671, LOG T671, LSG T671 LB T673, LV T673, LT T673, LW T673 LH T674 LS T676, LA T676, LO T676, LY T676, LB T676, LH T676, LSB T676, LW T676 LB T67C, LV T67C, LT T67C, LS T67K, LO T67K, LY T67K, LW E67C LS E67B, LA E67B, LO E67B, LY E67B, LB E67C, LV E67C, LT E67C LW T67C LS T679, LY T679, LG T679 LS T770, LO T770, LY T770, LG T770, LP T770 LB T773, LV T773, LT T773, LW T773 LH T774 LS E675, LA E675, LY E675, LS T675 LS T776, LA T776, LO T776, LY T776, LB T776 LHGB T686 LT T68C, LB T68C - Hyper Mini TOPLED® LB M676 - Mini TOPLED Santana® LG M470 LS M47K, LO M47K, LY M47K Source: http://www.osram.convergy.de LUXEON: - LUMILED® LXK2-PW12-R00, LXK2-PW12-S00, LXK2-PW14-U00, LXK2-PW14-V00 LXK2-PM12-R00, LXK2-PM12-S00, LXK2-PM14-U00 LXK2-PE12-Q00, LXK2-PE12-R00, LXK2-PE12-S00, LXK2-PE14-T00, LXK2-PE14-U00 LXK2-PB12-K00, LXK2-PB12-L00, LXK2-PB12-M00, LXK2-PB14-N00, LXK2-PB14-P00, LXK2-PB14-Q00 LXK2-PR12-L00, LXK2-PR12-M00, LXK2-PR14-Q00, LXK2-PR14-R00 LXK2-PD12-Q00, LXK2-PD12-R00, LXK2-PD12-S00 LXK2-PH12-R00, LXK2-PH12-S00 LXK2-PL12-P00, LXK2-PL12-Q00, LXK2-PL12-R00 Source: www.luxeon.com KINGBRIGHT: KA-3528ASYC Source: www.kingbright.com
LED17 LED20-LED24 = led:LED: LED OSRAM: - CHIPLED LG R971, LG N971, LY N971, LG Q971, LY Q971, LO R971, LY R971 LH N974, LH R974 LS Q976, LO Q976, LY Q976 LO Q996 - Hyper CHIPLED LW Q18S LB Q993, LB Q99A, LB R99A - SideLED LS A670, LO A670, LY A670, LG A670, LP A670 LB A673, LV A673, LT A673, LW A673 LH A674 LY A675 LS A676, LA A676, LO A676, LY A676, LW A676 LS A679, LY A679, LG A679 - Hyper Micro SIDELED® LS Y876, LA Y876, LO Y876, LY Y876 LT Y87S - SmartLED LW L88C, LW L88S LB L89C, LB L89S, LG L890 LS L89K, LO L89K, LY L89K LS L896, LA L896, LO L896, LY L896 - TOPLED LS T670, LO T670, LY T670, LG T670, LP T670 LSG T670, LSP T670, LSY T670, LOP T670, LYG T670 LG T671, LOG T671, LSG T671 LB T673, LV T673, LT T673, LW T673 LH T674 LS T676, LA T676, LO T676, LY T676, LB T676, LH T676, LSB T676, LW T676 LB T67C, LV T67C, LT T67C, LS T67K, LO T67K, LY T67K, LW E67C LS E67B, LA E67B, LO E67B, LY E67B, LB E67C, LV E67C, LT E67C LW T67C LS T679, LY T679, LG T679 LS T770, LO T770, LY T770, LG T770, LP T770 LB T773, LV T773, LT T773, LW T773 LH T774 LS E675, LA E675, LY E675, LS T675 LS T776, LA T776, LO T776, LY T776, LB T776 LHGB T686 LT T68C, LB T68C - Hyper Mini TOPLED® LB M676 - Mini TOPLED Santana® LG M470 LS M47K, LO M47K, LY M47K Source: http://www.osram.convergy.de LUXEON: - LUMILED® LXK2-PW12-R00, LXK2-PW12-S00, LXK2-PW14-U00, LXK2-PW14-V00 LXK2-PM12-R00, LXK2-PM12-S00, LXK2-PM14-U00 LXK2-PE12-Q00, LXK2-PE12-R00, LXK2-PE12-S00, LXK2-PE14-T00, LXK2-PE14-U00 LXK2-PB12-K00, LXK2-PB12-L00, LXK2-PB12-M00, LXK2-PB14-N00, LXK2-PB14-P00, LXK2-PB14-Q00 LXK2-PR12-L00, LXK2-PR12-M00, LXK2-PR14-Q00, LXK2-PR14-R00 LXK2-PD12-Q00, LXK2-PD12-R00, LXK2-PD12-S00 LXK2-PH12-R00, LXK2-PH12-S00 LXK2-PL12-P00, LXK2-PL12-Q00, LXK2-PL12-R00 Source: www.luxeon.com KINGBRIGHT: KA-3528ASYC Source: www.kingbright.com; SPICEPREFIX: L
LED18 = led:LED: LED OSRAM: - CHIPLED LG R971, LG N971, LY N971, LG Q971, LY Q971, LO R971, LY R971 LH N974, LH R974 LS Q976, LO Q976, LY Q976 LO Q996 - Hyper CHIPLED LW Q18S LB Q993, LB Q99A, LB R99A - SideLED LS A670, LO A670, LY A670, LG A670, LP A670 LB A673, LV A673, LT A673, LW A673 LH A674 LY A675 LS A676, LA A676, LO A676, LY A676, LW A676 LS A679, LY A679, LG A679 - Hyper Micro SIDELED® LS Y876, LA Y876, LO Y876, LY Y876 LT Y87S - SmartLED LW L88C, LW L88S LB L89C, LB L89S, LG L890 LS L89K, LO L89K, LY L89K LS L896, LA L896, LO L896, LY L896 - TOPLED LS T670, LO T670, LY T670, LG T670, LP T670 LSG T670, LSP T670, LSY T670, LOP T670, LYG T670 LG T671, LOG T671, LSG T671 LB T673, LV T673, LT T673, LW T673 LH T674 LS T676, LA T676, LO T676, LY T676, LB T676, LH T676, LSB T676, LW T676 LB T67C, LV T67C, LT T67C, LS T67K, LO T67K, LY T67K, LW E67C LS E67B, LA E67B, LO E67B, LY E67B, LB E67C, LV E67C, LT E67C LW T67C LS T679, LY T679, LG T679 LS T770, LO T770, LY T770, LG T770, LP T770 LB T773, LV T773, LT T773, LW T773 LH T774 LS E675, LA E675, LY E675, LS T675 LS T776, LA T776, LO T776, LY T776, LB T776 LHGB T686 LT T68C, LB T68C - Hyper Mini TOPLED® LB M676 - Mini TOPLED Santana® LG M470 LS M47K, LO M47K, LY M47K Source: http://www.osram.convergy.de LUXEON: - LUMILED® LXK2-PW12-R00, LXK2-PW12-S00, LXK2-PW14-U00, LXK2-PW14-V00 LXK2-PM12-R00, LXK2-PM12-S00, LXK2-PM14-U00 LXK2-PE12-Q00, LXK2-PE12-R00, LXK2-PE12-S00, LXK2-PE14-T00, LXK2-PE14-U00 LXK2-PB12-K00, LXK2-PB12-L00, LXK2-PB12-M00, LXK2-PB14-N00, LXK2-PB14-P00, LXK2-PB14-Q00 LXK2-PR12-L00, LXK2-PR12-M00, LXK2-PR14-Q00, LXK2-PR14-R00 LXK2-PD12-Q00, LXK2-PD12-R00, LXK2-PD12-S00 LXK2-PH12-R00, LXK2-PH12-S00 LXK2-PL12-P00, LXK2-PL12-Q00, LXK2-PL12-R00 Source: www.luxeon.com KINGBRIGHT: KA-3528ASYC Source: www.kingbright.com; SPICEPREFIX: X
LED19 = led:LED: LED OSRAM: - CHIPLED LG R971, LG N971, LY N971, LG Q971, LY Q971, LO R971, LY R971 LH N974, LH R974 LS Q976, LO Q976, LY Q976 LO Q996 - Hyper CHIPLED LW Q18S LB Q993, LB Q99A, LB R99A - SideLED LS A670, LO A670, LY A670, LG A670, LP A670 LB A673, LV A673, LT A673, LW A673 LH A674 LY A675 LS A676, LA A676, LO A676, LY A676, LW A676 LS A679, LY A679, LG A679 - Hyper Micro SIDELED® LS Y876, LA Y876, LO Y876, LY Y876 LT Y87S - SmartLED LW L88C, LW L88S LB L89C, LB L89S, LG L890 LS L89K, LO L89K, LY L89K LS L896, LA L896, LO L896, LY L896 - TOPLED LS T670, LO T670, LY T670, LG T670, LP T670 LSG T670, LSP T670, LSY T670, LOP T670, LYG T670 LG T671, LOG T671, LSG T671 LB T673, LV T673, LT T673, LW T673 LH T674 LS T676, LA T676, LO T676, LY T676, LB T676, LH T676, LSB T676, LW T676 LB T67C, LV T67C, LT T67C, LS T67K, LO T67K, LY T67K, LW E67C LS E67B, LA E67B, LO E67B, LY E67B, LB E67C, LV E67C, LT E67C LW T67C LS T679, LY T679, LG T679 LS T770, LO T770, LY T770, LG T770, LP T770 LB T773, LV T773, LT T773, LW T773 LH T774 LS E675, LA E675, LY E675, LS T675 LS T776, LA T776, LO T776, LY T776, LB T776 LHGB T686 LT T68C, LB T68C - Hyper Mini TOPLED® LB M676 - Mini TOPLED Santana® LG M470 LS M47K, LO M47K, LY M47K Source: http://www.osram.convergy.de LUXEON: - LUMILED® LXK2-PW12-R00, LXK2-PW12-S00, LXK2-PW14-U00, LXK2-PW14-V00 LXK2-PM12-R00, LXK2-PM12-S00, LXK2-PM14-U00 LXK2-PE12-Q00, LXK2-PE12-R00, LXK2-PE12-S00, LXK2-PE14-T00, LXK2-PE14-U00 LXK2-PB12-K00, LXK2-PB12-L00, LXK2-PB12-M00, LXK2-PB14-N00, LXK2-PB14-P00, LXK2-PB14-Q00 LXK2-PR12-L00, LXK2-PR12-M00, LXK2-PR14-Q00, LXK2-PR14-R00 LXK2-PD12-Q00, LXK2-PD12-R00, LXK2-PD12-S00 LXK2-PH12-R00, LXK2-PH12-S00 LXK2-PL12-P00, LXK2-PL12-Q00, LXK2-PL12-R00 Source: www.luxeon.com KINGBRIGHT: KA-3528ASYC Source: www.kingbright.com; SPICEPREFIX: B
Q1 = crystal:CRYSTAL: CRYSTAL; OC_FARNELL: 1666969; OC_NEWARK: unknown
R1 R3-R46 = rcl:R-EU_: RESISTOR, European symbol; SPICEPREFIX: R
R2 = pot:TRIM_EU-: POTENTIOMETER
S1-S8 = switch-omron:10-XX: OMRON SWITCH; MPN: B3F-1000; OC_FARNELL: 176432; OC_NEWARK: 36M3542
SV1 = con-ml:ML10: HARTING; OC_FARNELL: unknown; OC_NEWARK: unknown
T1-T15 T17-T24 = transistor:BC847: NPN TRANSISTOR
T16 = transistor:BC847: NPN TRANSISTOR; SPICEPREFIX: J
U$1 = lsd2016:LCD
U$2 = lsd2016:DISPLAY_FRAME
X1 = con-subd:F09: SUB-D; OC_FARNELL: unknown; OC_NEWARK: unknown

## Board
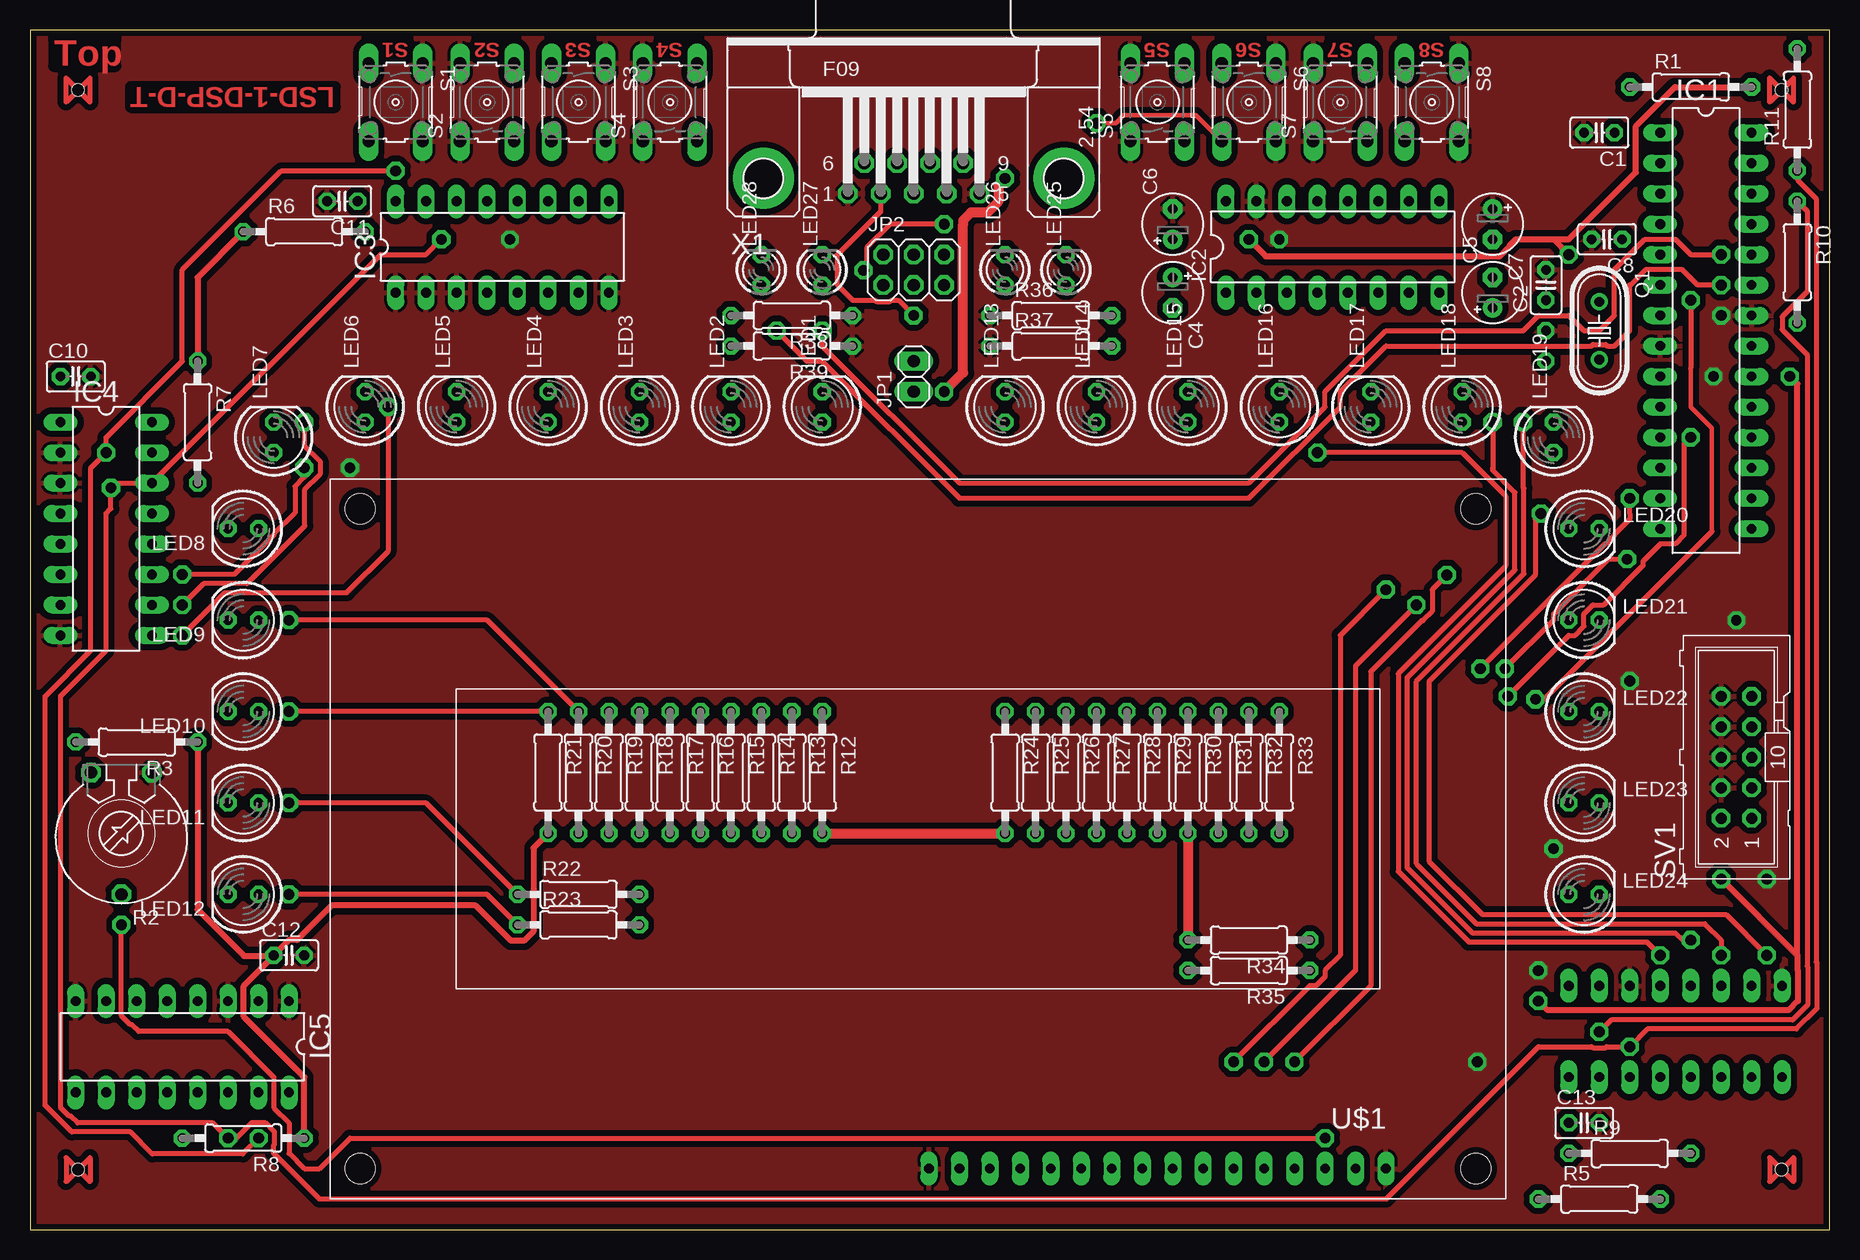
[diagram p8: board, top side]
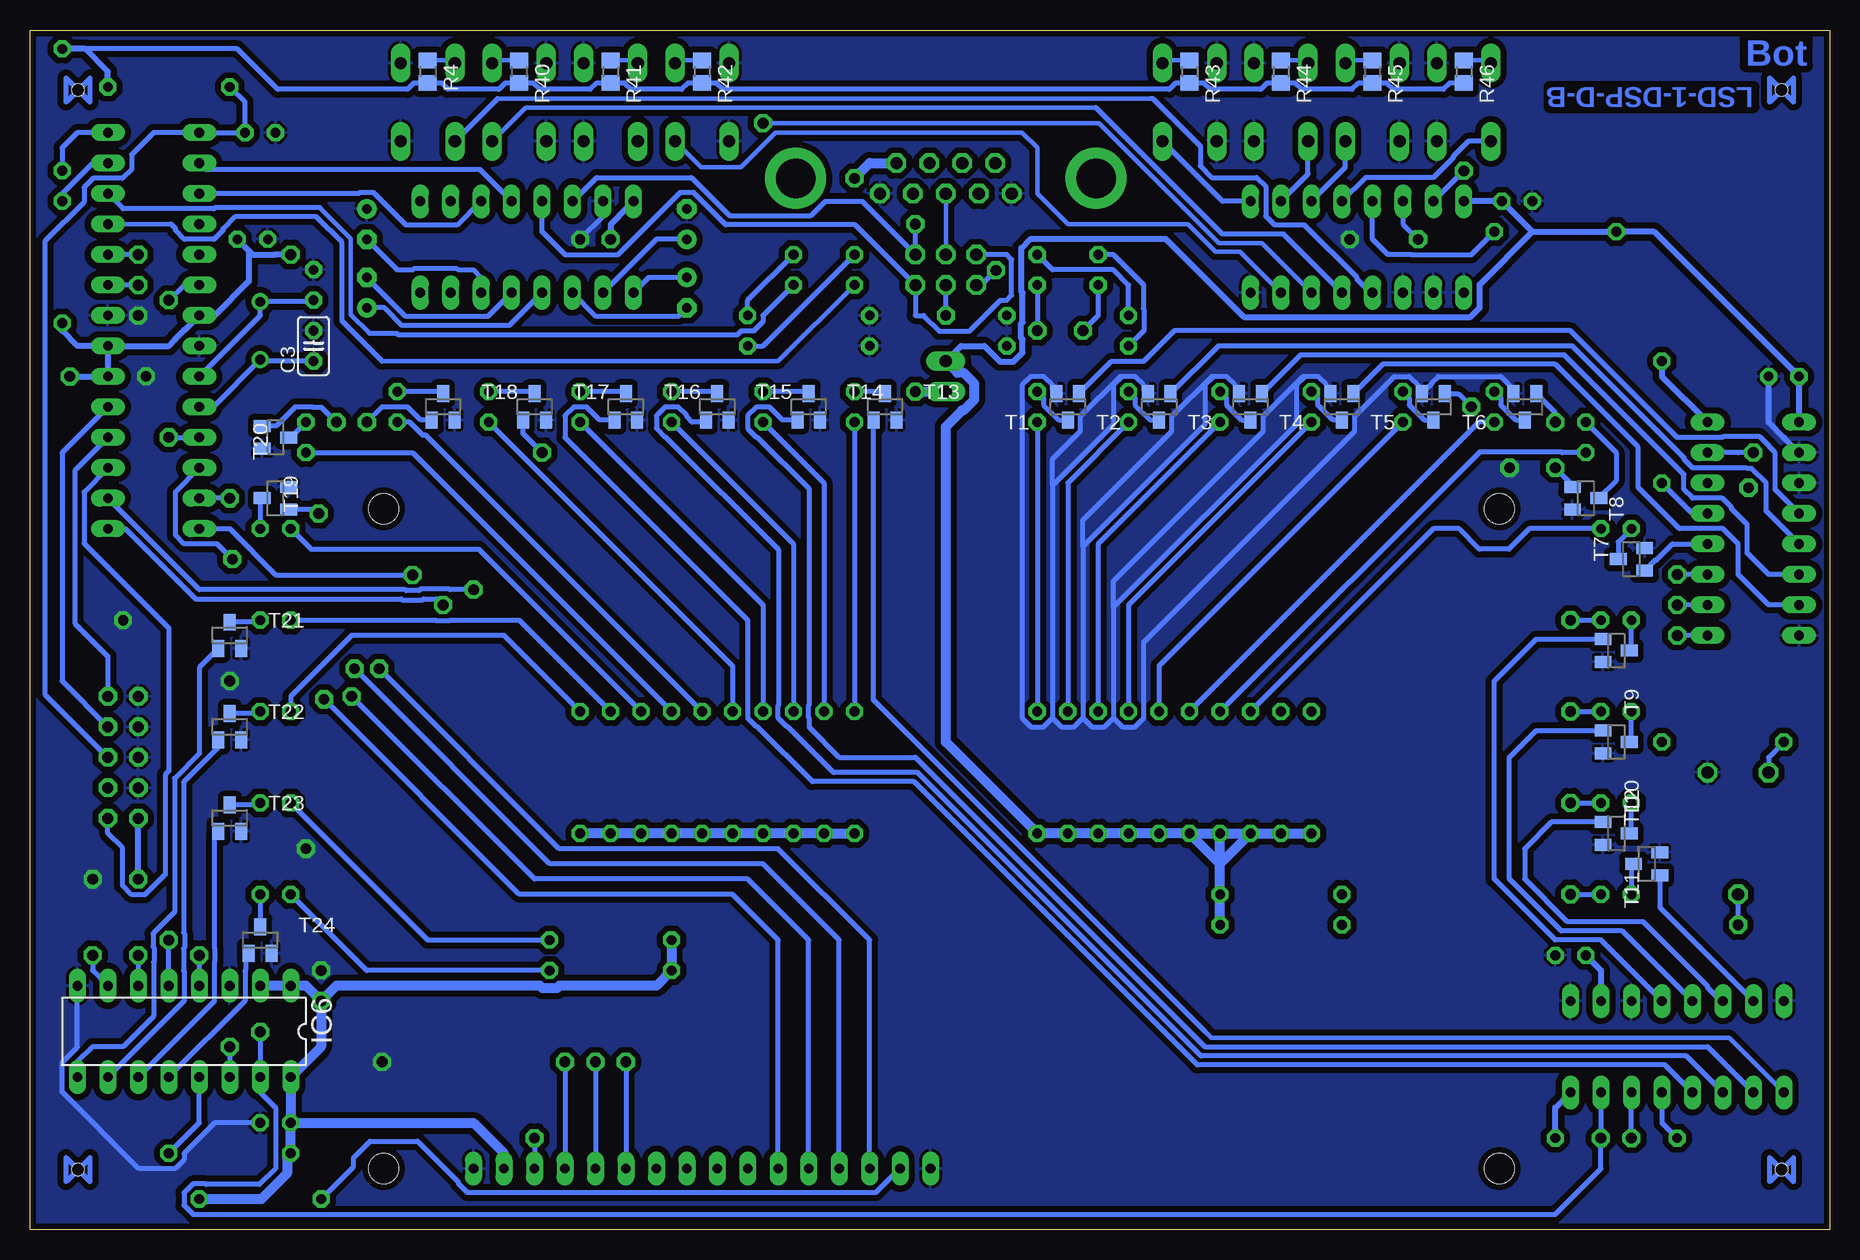
[diagram p9: board, bottom side, seen from below]

Size 150 x 100 mm. Coordinates in mm from the lower left corner, seen from the top.
Copper layers (1*16): Top 0.035mm / dielectric 1.5mm / Bottom 0.035mm
Design rules "default *": minimum track width 14mil, minimum drill 0.8mm, track to track 14mil, track to pad 14mil, pad to pad 14mil, via to via 14mil, smd to smd 14mil, copper to edge 16mil, drill to drill 6mil, minimum pad ring 12mil, minimum via ring 12mil, stop-mask expansion 4mil, vias tented up to drill 0mil, thermal gap 10mil

### Footprints (pad centres in the part's own frame; a part is rotated, then mirrored left to right if it is on the bottom)
C025-025X050 = drill 0.813 octagon: 1 -1.27,0; 2 1.27,0
E2,5-5 = drill 0.813 pad 1.6: + -1.27,0 | drill 0.813 pad 1.6 octagon: - 1.27,0
DIL28-3 = drill 0.813 long: 1 -16.51,-3.81; 2 -13.97,-3.81; 3 -11.43,-3.81; 4 -8.89,-3.81; 5 -6.35,-3.81; 6 -3.81,-3.81; 7 -1.27,-3.81; 8 1.27,-3.81; 9 3.81,-3.81; 10 6.35,-3.81; 11 8.89,-3.81; 12 11.43,-3.81; 13 13.97,-3.81; 14 16.51,-3.81; 15 16.51,3.81; 16 13.97,3.81; 17 11.43,3.81; 18 8.89,3.81; 19 6.35,3.81; 20 3.81,3.81; 21 1.27,3.81; 22 -1.27,3.81; 23 -3.81,3.81; 24 -6.35,3.81; 25 -8.89,3.81; 26 -11.43,3.81; 27 -13.97,3.81; 28 -16.51,3.81
DIL16 = drill 0.813 long: 1 -8.89,-3.81; 2 -6.35,-3.81; 3 -3.81,-3.81; 4 -1.27,-3.81; 5 1.27,-3.81; 6 3.81,-3.81; 7 6.35,-3.81; 8 8.89,-3.81; 9 8.89,3.81; 10 6.35,3.81; 11 3.81,3.81; 12 1.27,3.81; 13 -1.27,3.81; 14 -3.81,3.81; 15 -6.35,3.81; 16 -8.89,3.81
1X02 = drill 1.016 long: 1 -1.27,0; 2 1.27,0
2X03 = drill 1.016 octagon: 1 -2.54,-1.27; 2 -2.54,1.27; 3 0,-1.27; 4 0,1.27; 5 2.54,-1.27; 6 2.54,1.27
LED5MM = drill 0.813 octagon: A -1.27,0; K 1.27,0
LED3MM = drill 0.813 octagon: A -1.27,0; K 1.27,0
HC49U-V = drill 0.813: 1 -2.413,0; 2 2.413,0
0207/10 = drill 0.813 octagon: 1 -5.08,0; 2 5.08,0
PT-10 = drill 1.016 octagon: A -2.54,-5.08; E 2.54,-5.08; S 0,5.08
R0805 = smd 1.3 x 1.5: 1 -0.95,0; 2 0.95,0
B3F-10XX = drill 1.016 long: 1 -3.251,2.261; 2 3.251,2.261; 3 -3.251,-2.261; 4 3.251,-2.261
ML10 = drill 0.914 octagon: 1 -5.08,-1.27; 2 -5.08,1.27; 3 -2.54,-1.27; 4 -2.54,1.27; 5 0,-1.27; 6 0,1.27; 7 2.54,-1.27; 8 2.54,1.27; 9 5.08,-1.27; 10 5.08,1.27
SOT23 = smd 1 x 1.4: 1 -0.95,-1.1; 2 0.95,-1.1; 3 0,1.1
LCD = drill 0.813 long: 1 0,0; 2 2.54,0; 3 5.08,0; 4 7.62,0; 5 10.16,0; 6 12.7,0; 7 15.24,0; 8 17.78,0; 9 20.32,0; 10 22.86,0; 11 25.4,0; 12 27.94,0; 13 30.48,0; 14 33.02,0; 15 35.56,0; 16 38.1,0 | hole 2.5: -7.5,0; 85.5,0; -7.5,-55; 85.5,-55
DISPLAY_FRAME = hole 1: 4,95; 146,5; 4,5; 146,95
F09HP = drill 1.016 octagon: 1 -5.486,-1.27; 2 -2.743,-1.27; 3 0,-1.27; 4 2.743,-1.27; 5 5.486,-1.27; 6 -4.115,1.27; 7 -1.372,1.27; 8 1.372,1.27; 9 4.115,1.27 | drill 3.302 pad 5.08: G1 -12.522,0; G2 12.522,0

### Placement (x,y rotation side)
C1  130.81,91.44 180 top
C2  126.36,78.74 90 top
C3  126.36,73.66 90 bottom
C4  95.25,78.11 270 top
C5  121.92,78.11 90 top
C6  95.25,83.82 90 top
C7  121.92,83.82 270 top
C8  131.44,82.55 180 top
C10  3.81,71.12 0 top
C11  26.04,85.72 180 top
C12  21.59,22.86 0 top
C13  129.54,8.89 0 top
IC1  139.7,74.93 270 top
IC2  108.58,81.92 0 top
IC3  39.37,81.92 0 top
IC4  6.35,58.42 270 top
IC5  12.7,15.24 180 top
IC6  137.16,16.51 180 bottom
JP1  73.66,71.12 90 top
JP2  73.66,80.01 0 top
LED1  66.04,68.58 90 top
LED2  58.42,68.58 90 top
LED3  50.8,68.58 90 top
LED4  43.18,68.58 90 top
LED5  35.56,68.58 90 top
LED6  27.94,68.58 90 top
LED7  20.32,66.04 90 top
LED8  17.78,58.42 180 top
LED9  17.78,50.8 180 top
LED10  17.78,43.18 180 top
LED11  17.78,35.56 180 top
LED12  17.78,27.94 180 top
LED13  81.28,68.58 90 top
LED14  88.9,68.58 90 top
LED15  96.52,68.58 90 top
LED16  104.14,68.58 90 top
LED17  111.76,68.58 90 top
LED18  119.38,68.58 90 top
LED19  127,66.04 90 top
LED20  129.54,58.42 0 top
LED21  129.54,50.8 0 top
LED22  129.54,43.18 0 top
LED23  129.54,35.56 0 top
LED24  129.54,27.94 0 top
LED25  86.36,80.01 90 top
LED26  81.28,80.01 90 top
LED27  66.04,80.01 90 top
LED28  60.96,80.01 90 top
Q1  130.81,74.93 270 top
R1  138.43,95.25 0 top
R2  7.62,33.02 180 top
R3  8.89,40.64 180 top
R4  116.84,96.52 270 bottom
R5  130.81,2.54 0 top
R6  22.86,83.19 0 top
R7  13.97,67.31 270 top
R8  17.78,7.62 180 top
R9  133.35,6.35 0 top
R10  147.32,80.64 270 top
R11  147.32,93.34 90 top
R12  66.04,38.1 270 top
R13  63.5,38.1 270 top
R14  60.96,38.1 270 top
R15  58.42,38.1 270 top
R16  55.88,38.1 270 top
R17  53.34,38.1 270 top
R18  50.8,38.1 270 top
R19  48.26,38.1 270 top
R20  45.72,38.1 270 top
R21  43.18,38.1 270 top
R22  45.72,27.94 0 top
R23  45.72,25.4 0 top
R24  81.28,38.1 270 top
R25  83.82,38.1 270 top
R26  86.36,38.1 270 top
R27  88.9,38.1 270 top
R28  91.44,38.1 270 top
R29  93.98,38.1 270 top
R30  96.52,38.1 270 top
R31  99.06,38.1 270 top
R32  101.6,38.1 270 top
R33  104.14,38.1 270 top
R34  101.6,24.13 180 top
R35  101.6,21.59 180 top
R36  85.09,76.2 0 top
R37  85.09,73.66 0 top
R38  63.5,76.2 180 top
R39  63.5,73.66 180 top
R40  109.22,96.52 270 bottom
R41  101.6,96.52 270 bottom
R42  93.98,96.52 270 bottom
R43  53.34,96.52 270 bottom
R44  45.72,96.52 270 bottom
R45  38.1,96.52 270 bottom
R46  30.48,96.52 270 bottom
S1  30.48,93.98 270 top
S2  38.1,93.98 90 top
S3  45.72,93.98 270 top
S4  53.34,93.98 90 top
S5  93.98,93.98 90 top
S6  101.6,93.98 270 top
S7  109.22,93.98 90 top
S8  116.84,93.98 270 top
SV1  142.24,39.37 90 top
T1  63.5,68.58 180 bottom
T2  55.88,68.58 180 bottom
T3  48.26,68.58 180 bottom
T4  40.64,68.58 180 bottom
T5  33.02,68.58 180 bottom
T6  25.4,68.58 180 bottom
T7  20.32,60.96 270 bottom
T8  16.51,55.88 90 bottom
T9  17.78,48.26 270 bottom
T10  17.78,40.64 270 bottom
T11  17.78,33.02 270 bottom
T12  15.24,30.48 90 bottom
T13  78.74,68.58 0 bottom
T14  85.09,68.58 0 bottom
T15  92.71,68.58 0 bottom
T16  100.33,68.58 0 bottom
T17  107.95,68.58 0 bottom
T18  115.57,68.58 0 bottom
T19  129.54,66.04 270 bottom
T20  129.54,60.96 90 bottom
T21  133.35,49.53 0 bottom
T22  133.35,41.91 0 bottom
T23  133.35,34.29 0 bottom
T24  130.81,24.13 0 bottom
U$1  113.03,5.08 180 top
U$2  0,0 0 top
X1  73.66,87.63 0 top

### Tracks (layer width: path | path; a pad name or v marks a point on that pad's centre or on a via)
+5V  (via drill 0.9)
  Top 0.508: R6.1 13.97,79.38 R7.1 | v140.97,29.21 147.32,22.86 | R8.1 22.86,12.7 17.83,17.73 17.83,20.31 20.32,22.8 | 127,82.55 v128.27,81.28 | 127,82.55 123.84,82.55 123.33,82.04 123.33,81.97 122.5,81.14 103.01,81.14 v101.6,82.55 | 127,82.55 128.27,82.55 133.86,88.14 133.86,91.99 137.12,95.25 R1.2 | R3.1 13.97,26.67 17.84,22.8 20.32,22.8 | 147.32,22.86 147.32,21.63 147.37,21.58 147.37,19.06 146.6,18.29 126.49,18.29 v125.73,19.05 | R21.2 41.96,31.8 41.96,24.85 41.19,24.08 40.09,24.08 37.17,27.01 25.14,27.01 22.26,24.13 21.59,24.13 C12.1 20.32,22.8 | 147.32,22.86 147.32,70.48 v146.69,71.12
  Top 0.813: R30.2 R34.2 | R12.2 R24.2
  Bottom 0.406: R46.2 31.65,95.57 32.17,95.05 36.41,95.05 36.93,95.57 R45.2 39.27,95.57 39.79,95.05 44.03,95.05 44.55,95.57 R44.2 46.89,95.57 47.41,95.05 51.65,95.05 52.17,95.57 R43.2 54.51,95.57 55.03,95.05 92.29,95.05 92.81,95.57 R42.2 95.15,95.57 95.67,95.05 99.91,95.05 100.43,95.57 R41.2 102.77,95.57 103.29,95.05 107.53,95.05 108.05,95.57 R40.2 110.39,95.57 110.91,95.05 115.15,95.05 115.67,95.57 R4.2 118.01,95.57 118.53,95.05 129.34,95.05 132.72,98.42 145.41,98.42
  Bottom 0.508: IC1.21 IC1.20 v146.69,71.12 | IC1.21 138.43,73.66 137.92,74.17 137.92,74.21 137.15,74.98 137.11,74.98 IC1.7 134.62,76.2 131.76,79.06 131.76,81.6 | IC4.1 C10.1 14.61,83.19 R6.1 24.77,83.19 | R7.1 13.97,71.12 IC4.16 | IC3.16 C11.1 24.77,83.19 | R1.2 143.51,96.52 145.41,98.42 R11.2 | v140.97,29.21 SV1.2 | 131.76,81.6 C8.1 | R8.1 22.86,10.16 IC5.16 | JP1.2 72.39,73.66 70.45,73.66 69.13,72.34 68.03,72.34 67.26,73.11 67.26,74.22 67.4,74.36 67.4,75.5 67.26,75.64 67.26,78.09 67.36,78.19 67.36,81.83 66.59,82.6 55.34,82.6 48.81,76.07 29.93,76.07 29.16,76.85 29.16,78.79 24.77,83.19 | C12.1 19.05,21.59 IC5.2 | IC2.16 100.91,84.51 100.91,84.47 101.6,83.78 v101.6,82.55 | IC1.21 146.05,73.66 147.32,74.93 R10.2 | v128.27,81.28 129.58,81.28 129.63,81.23 131.39,81.23 131.76,81.6
  Bottom 0.813: C13.1 IC6.16 125.73,15.24 v125.73,19.05 | IC6.2 IC6.1 127,20.32 v125.73,19.05 | R23.2 R22.2 50.8,30.48 | R24.2 R25.2 R26.2 R27.2 R28.2 R29.2 R30.2 R31.2 R32.2 R33.2 | R34.2 R35.2 97.79,20.32 105.87,20.32 106.07,20.12 107.29,20.12 107.49,20.32 124.46,20.32 v125.73,19.05 | 50.8,30.48 R18.2 | R18.2 R19.2 | R19.2 R20.2 R21.2 | R17.2 R16.2 R15.2 R14.2 R13.2 R12.2 73.66,40.64 73.66,66.93 72.32,68.28 72.19,68.28 71.27,69.2 71.27,70.5 72.19,71.42 72.69,71.42 JP1.2 | 50.8,30.48 R17.2 | 50.8,30.48 R19.2 | R17.2 R18.2 | U$1.2 110.49,6.35 113.03,8.89 C13.1 | C13.1 R9.1 128.57,6.04 128.57,4.68 130.72,2.54 R5.2
BTN0
  Bottom 0.356: IC3.4 38.29,78.11 | 56.56,94.28 111.02,94.28
  Bottom 0.406: 111.02,94.28 S8.4 | 56.56,94.28 56.4,94.28 52.45,90.33 52.45,88.66 51.5,87.71 47.73,87.71 46.99,86.96 46.99,84.49 46.25,83.74 43.77,83.74 39.37,79.34 39.37,79.18 38.29,78.11
BTN1
  Bottom 0.356: 61.15,93.52 108.69,93.52 S7.3
  Bottom 0.406: 61.15,93.52 50.61,82.98 45.52,82.98 IC3.5
BTN2  (via drill 0.9)
  Top 0.356: v88.9,92.23 90.51,92.23 91.16,92.89 97.18,92.89 S6.4
  Bottom 0.356: v88.9,92.23 60.9,92.23 50.91,82.25 47.32,82.25 IC3.6
BTN3
  Bottom 0.356: IC3.7 49.15,81.53 51.21,81.53 53.49,83.82 63.5,83.82 66.04,86.36 66.04,90.17 67.31,91.44 69.85,91.44 87.87,91.44 90.74,88.57 94.08,88.57 S5.3
BTN4
  Bottom 0.406: IC3.9 50.6,85.72 S4.3
BTN5
  Bottom 0.406: IC3.10 43.46,87.99 S3.4
BTN6
  Bottom 0.406: IC3.11 40.36,88.54 S2.3
BTN7
  Bottom 0.406: S1.4 30.11,90.73 31.37,89.47 31.37,89.35 33.01,87.71 38.66,87.71 IC3.12
D4  (via drill 0.9)
  Top 0.356: 138.43,71.8 138.43,68.58 140.21,66.8 140.21,58.2
  Top 0.406: 140.21,58.2 126.22,44.21 v125.49,44.21 | v138.43,77.47 138.43,71.8
  Bottom 0.406: U$1.11 87.63,24.13 91.44,27.94 109.22,27.94 v125.49,44.21 | v138.43,77.47 137.16,78.74 IC1.6
D5  (via drill 0.9)
  Top 0.406: v138.43,66.04 137.87,65.48 137.87,57.89 137.13,57.15 135.89,57.15 134.45,55.71 134.45,55.34 131.18,52.07 130.28,52.07 129.54,51.33 129.54,50.27 128.8,49.53 128.27,49.53 v123.19,44.45
  Bottom 0.406: U$1.12 85.09,24.13 90.17,29.21 107.95,29.21 v123.19,44.45 | v138.43,66.04 IC1.11
D6  (via drill 0.9)
  Top 0.406: v122.95,46.75 127,50.8 127,51.33 131.55,55.88 v133.13,55.88
  Bottom 0.406: U$1.13 82.55,24.13 88.9,30.48 106.68,30.48 v122.95,46.75 | IC1.12 135.89,63.47 137.87,61.49 137.87,57.89 137.13,57.15 134.4,57.15 v133.13,55.88
D7  (via drill 0.9)
  Top 0.406: v133.35,60.96 133.35,59.69 133.35,59.22 132.08,57.95 132.08,57.89 131.34,57.15 131.28,57.15 v120.89,46.75
  Bottom 0.406: U$1.14 80.01,24.13 87.63,31.75 105.89,31.75 v120.89,46.75 | v133.35,60.96 IC1.13
EN  (via drill 0.9)
  Top 0.406: v113.03,53.34 109.22,49.53 109.22,22.86 107.95,21.59 107.95,21.06 107.21,20.32 106.68,20.32 v100.33,13.97
  Bottom 0.406: IC1.16 135.89,53.34 118.73,53.34 118.65,53.26 117.57,53.26 117.44,53.38 115.03,53.38 114.98,53.34 v113.03,53.34 | v100.33,13.97 U$1.6
GND  (via drill 0.85, 0.9)
  Bottom 0.406: 64.77,42.65 65.51,41.91 66.57,41.91 67.31,42.65 67.31,70.38 66.57,71.12 65.51,71.12 64.77,70.38 64.77,70 T1.2 | 58.95,71.12 59.12,71.12 62.44,67.8 62.44,66.55 64.77,64.22 64.77,62.04 | 58.95,71.12 57.89,71.12 57.15,70.38 57.15,70 T2.2 | 58.95,71.12 59.69,70.38 59.69,67.12 64.77,62.04 | 64.77,42.65 64.03,41.91 62.97,41.91 62.23,42.65 | 64.77,62.04 64.77,42.65 | 51.33,71.12 51.5,71.12 54.82,67.8 54.82,66.55 62.23,59.14 62.23,56.96 | 51.33,71.12 50.27,71.12 49.53,70.38 49.53,70 T3.2 | 51.33,71.12 52.07,70.38 52.07,67.12 62.23,56.96 | 62.23,42.65 61.49,41.91 60.43,41.91 59.69,42.65 | 62.23,56.96 62.23,42.65 | 43.71,71.12 43.88,71.12 47.2,67.8 47.2,66.55 59.69,54.06 59.69,51.88 | 43.71,71.12 42.65,71.12 41.91,70.38 41.91,70 T4.2 | 43.71,71.12 44.45,70.38 44.45,67.12 59.69,51.88 | 59.69,42.65 58.95,41.91 57.89,41.91 57.15,42.65 57.15,48.98 39.58,66.55 39.58,67.8 36.26,71.12 35.03,71.12 34.29,70.38 34.29,70 T5.2 33.13,70.52 33.13,70.61 32.62,71.12 27.41,71.12 26.67,70.38 26.67,70 T6.2 | 59.69,51.88 59.69,42.65 | C13.2 134.62,8.89 137.16,6.35 137.16,5.82 137.9,5.08 140.94,5.08 147.32,11.46 147.32,13.94 146.05,15.21 IC6.8 | IC2.15 102.23,84.45 v104.14,82.55
  Bottom 0.508: IC4.2 3.76,65.99 3.8,65.99 5.08,67.27 C10.2
  other vias: 140.97,76.2 26.67,63.5 125.73,21.59 120.65,13.97 127,31.75 133.35,45.72 144.78,29.21 140.34,71.12 40.01,82.55 142.24,50.8
  pour Bottom (isolate 0.508): 0,100.33 151.13,100.33 151.13,0 0,0
  pour Top (isolate 0.508): 0,100.33 151.13,100.33 151.13,0 0,0
LED0
  Bottom 0.406: T1.1 59.84,72.39 57.15,72.39 54.61,74.93 21.59,74.93 12.7,66.04 8.92,66.04 8.87,66.09 5.81,66.09 5.04,65.31 5.04,65.28 4.52,64.77 4.52,61.67 IC4.4
LED1
  Bottom 0.406: T2.1 50.95,73.66 21.43,73.66 12.14,64.37 12.14,64.24 11.4,63.5 6.94,63.5 6.89,63.46 6.51,63.46 5.28,62.23 5.28,59.89 IC4.5
LED2
  Bottom 0.406: T3.1 44.09,72.9 22.1,72.9 12.14,62.94 12.14,61.7 11.4,60.96 8.92,60.96 8.18,60.22 8.18,60.09 6.86,58.77 6.86,58.42 6.86,56.39 5.08,54.61 IC4.6
LED3
  Bottom 0.406: T4.1 37.23,72.14 22.86,72.14 15.95,65.23 15.95,61.86 12.51,58.42 8.89,58.42 7.62,57.15 7.62,54.61 5.08,52.07 IC4.7
LED4  (via drill 0.9)
  Top 0.406: v12.7,49.53 16.26,53.09 26.42,53.09 29.84,56.52 v29.84,68.58
  Bottom 0.406: IC4.9 v12.7,49.53 | T5.1 30.95,69.68 v29.84,68.58
LED5  (via drill 0.9)
  Top 0.406: v12.7,52.07 14.48,53.85 18.1,53.85 22.9,58.66 22.86,58.7 22.86,61.64 24.17,62.96 24.17,64.04 22.86,65.36 v22.86,67.31
  Bottom 0.406: IC4.10 v12.7,52.07 | T6.1 22.86,68.09 v22.86,67.31
LED6  (via drill 0.9)
  Top 0.406: v22.86,63.5 22.86,62.72 22.1,61.96 22.1,59.74 20.32,57.97 20.32,57.89 17.04,54.61 v12.7,54.61
  Bottom 0.406: IC4.11 v12.7,54.61 | T7.1 21.42,62.06 v22.86,63.5
LED7
  Bottom 0.406: T8.1 14.57,55.77 14.48,55.77 13.1,57.15 IC4.12
LED8
  Bottom 0.406: IC5.4 19.05,24.13 22.86,24.13 27.94,29.21 27.94,45.72 24.45,49.21 T9.1
LED9
  Bottom 0.406: T10.1 24.45,41.59 26.67,39.37 26.67,29.21 22.35,24.89 17.27,24.89 IC5.5
LED10
  Bottom 0.406: IC5.6 9.04,19.05 10.16,20.16 10.16,20.29 15.53,25.65 21.84,25.65 25.4,29.21 25.4,31.75 23.18,33.97 T11.1
LED11
  Bottom 0.406: T12.1 14.14,26.84 IC5.7
LED12
  Bottom 0.356: IC5.9 8.36,15.98 51.54,15.98 52.07,16.51
  Bottom 0.406: T13.1 79.69,44.13 52.07,16.51
LED13
  Bottom 0.406: IC5.10 10.16,15.24 52.07,15.24 76.2,39.37 82.55,39.37 85.04,41.86 85.04,42.6 85.09,42.65 85.09,43.71 85.04,43.76 85.04,61.73 89.35,66.04 89.43,66.04 90.17,66.78 90.17,67.84 89.43,68.58 88.37,68.58 87.27,67.48 T14.1
LED14
  Bottom 0.406: IC5.11 11.94,14.48 52.39,14.48 76.01,38.1 83,38.1 86.81,41.91 86.89,41.91 87.63,42.65 87.63,43.71 87.58,43.76 87.58,56.65 96.97,66.04 97.05,66.04 97.79,66.78 97.79,67.84 97.05,68.58 95.99,68.58 95.25,67.84 95.25,67.76 94.8,67.31 93.83,67.31 T15.1
LED15
  Bottom 0.406: IC5.12 13.72,13.72 52.7,13.72 76.32,37.34 84.78,37.34 89.35,41.91 89.43,41.91 90.17,42.65 90.17,50.8 105.41,66.04 105.41,67.84 104.67,68.58 103.61,68.58 102.51,67.48 T16.1
LED16  (via drill 0.9)
  Top 0.406: v107.31,64.77 119.38,64.77 123.01,61.14 123.01,55.31 114.05,46.35 114.05,29.85 119.93,23.97 134.78,23.97 v135.89,22.86
  Bottom 0.406: v135.89,22.86 IC6.4 | v107.31,64.77 108.9,66.36 T17.1
LED17  (via drill 0.9)
  Top 0.406: v121.92,67.31 121.92,63.5 | 121.92,63.5 121.92,63.31 | v138.43,24.13 137.76,24.13 137.16,24.73 120.24,24.73 114.81,30.16 114.81,45.72 | 114.81,45.72 114.81,46.04 | 114.81,45.72 114.81,46.04 | 121.92,63.31 121.92,63.5 | 114.81,46.04 123.77,55 123.77,61.46 121.92,63.31
  Bottom 0.406: T18.1 117.43,67.48 118.53,68.58 120.65,68.58 v121.92,67.31 | IC6.5 v138.43,24.13
LED18  (via drill 0.9)
  Top 0.406: v124.46,67.31 124.46,61.84 124.53,61.77 124.53,54.68 115.57,45.72 115.57,30.48 120.56,25.49 139.61,25.49 140.97,24.13 v140.97,22.86
  Bottom 0.406: v140.97,22.86 IC6.6 | T19.1 129.48,66.99 127.89,68.58 126.47,68.58 126.42,68.53 125.68,68.53 v124.46,67.31
LED19  (via drill 0.9)
  Top 0.406: v144.78,22.86 141.39,26.25 121.07,26.25 116.62,30.7 116.62,45.7 125.48,54.55 125.48,59.22 v125.95,59.69
  Bottom 0.406: v144.78,22.86 144.78,21.59 IC6.7 | v125.95,59.69 126.27,60.01 T20.1
LED20
  Bottom 0.406: IC6.9 146.05,13.97 144.78,15.24 142.24,15.24 139.7,17.78 139.7,22.27 139.66,22.32 139.66,23.5 139.74,23.59 139.74,24.67 137.96,26.46 137.96,37.62 135.89,39.69 135.89,46.84 T21.1
LED21
  Bottom 0.406: T22.1 134.3,40.2 137.2,37.3 137.2,24.75 137.12,24.67 137.12,23.49 137.2,23.4 137.2,21.6 137.16,21.56 137.16,19.05 IC6.10
LED22
  Bottom 0.406: IC6.11 134.62,19.05 134.62,22.27 134.58,22.32 134.58,23.4 134.62,23.45 134.62,32.87 | 134.62,32.87 T23.1 134.62,32.87
LED23
  Bottom 0.406: 132.03,22.76 T24.1 132.03,22.76 | 132.03,22.76 132.03,21.61 132.08,21.56 132.08,19.08 138.43,12.73 IC6.12
MISO
  Bottom 0.406: SV1.9 143.51,47.78 146.25,50.52 146.25,63.26 143.51,66.01 IC1.18
MOSI
  Bottom 0.406: IC1.17 143.51,63.47 145.49,61.49 145.49,57.19 138.43,50.13 138.43,38.22 138.72,37.93 138.72,29.6 140.43,27.9 141.51,27.9 142.29,28.67 142.29,31.8 143.51,33.02 SV1.1
N$1
  Bottom 0.406: C4.+ 98.42,79.38 IC2.1
N$2
  Bottom 0.406: IC1.9 130.81,76.2 Q1.1 126.49,77.34 C2.1
N$3
  Bottom 0.406: IC1.10 134.75,68.58 Q1.2 130.68,72.39 C3.1
N$4
  Bottom 0.406: C5.+ 120.46,76.83 118.98,75.36 110.06,75.36 IC2.4
N$5
  Bottom 0.406: IC2.5 111.84,76.12 118.67,76.12 C5.-
N$6
  Bottom 0.406: C4.- 95.96,76.12 102.79,76.12 IC2.3
N$7
  Bottom 0.406: C6.+ 97.79,82.55 IC2.2
N$8
  Bottom 0.406: C7.- 119.36,79.98 118.1,79.98 118,80.09 114.41,80.09 114.31,79.98 113.06,79.98 113.03,80.01 112.39,79.38 IC2.6
N$9
  Bottom 0.406: R3.2 5.08,39.37 R2.E
N$10  (via drill 0.9)
  Top 0.406: v107.95,7.62 26.67,7.62 24.13,5.08 22.86,5.08 21.59,6.35 21.59,8.89 20.32,10.16 20.32,12.7 16.51,16.51 9.04,16.51 8.49,17.07 8.36,17.07 7.62,17.81 v7.62,25.4
  Bottom 0.406: v7.62,25.4 R2.S | v107.95,7.62 U$1.3
N$11
  Bottom 0.406: R5.1 123.04,5.23 123.04,5.98 121.66,7.36 117.69,7.36 114.3,3.96 114.3,3.84 113.56,3.1 79.48,3.1 77.5,5.08 U$1.15
N$12
  Bottom 0.406: IC3.13 38.1,82.55 36.83,81.28 34.88,81.28 34.83,81.24 29.89,81.24 R6.2
N$13
  Bottom 0.406: IC4.13 11.43,59.69 R7.2
N$14
  Bottom 0.406: IC5.13 13.97,8.89 R8.2
N$15
  Bottom 0.406: LED1.A R12.1
N$16
  Bottom 0.406: R9.2 135.89,8.89 IC6.13
N$17
  Bottom 0.406: LED2.A 63.5,62.23 R13.1
N$18
  Bottom 0.406: LED3.A 60.96,57.15 R14.1
N$19
  Bottom 0.406: LED4.A 58.42,52.07 R15.1
N$20
  Bottom 0.406: LED5.A 55.88,46.99 R16.1
N$21
  Bottom 0.406: LED6.A 29.21,67.31 R17.1
N$22
  Bottom 0.406: LED7.A 22.27,64.77 22.32,64.81 29.17,64.81 R18.1
N$23
  Bottom 0.406: R19.1 33.02,58.42 30.87,58.42 29.17,56.72 26.71,56.72 25.01,58.42 LED8.A
N$24  (via drill 0.9)
  Top 0.406: R20.1 38.1,50.8 v21.59,50.8
  Bottom 0.406: v21.59,50.8 LED9.A
N$25  (via drill 0.9)
  Top 0.406: R21.1 v21.59,43.18
  Bottom 0.406: v21.59,43.18 LED10.A
N$26  (via drill 0.9)
  Top 0.406: R22.1 33.02,35.56 v21.59,35.56
  Bottom 0.406: v21.59,35.56 LED11.A
N$27  (via drill 0.9)
  Top 0.406: R23.1 38.1,27.94 v21.59,27.94
  Bottom 0.406: v21.59,27.94 LED12.A
N$28
  Bottom 0.406: LED13.A R24.1
N$29
  Bottom 0.406: LED14.A 83.82,62.23 R25.1
N$30
  Bottom 0.406: LED15.A 86.36,57.15 R26.1
N$31
  Bottom 0.406: LED16.A 88.9,52.07 R27.1
N$32
  Bottom 0.406: LED17.A 91.44,46.99 R28.1
N$33
  Bottom 0.406: R29.1 117.02,66.22 117.25,66.22 118.34,67.31 LED18.A
N$34
  Bottom 0.406: LED19.A 118.11,64.77 R30.1
N$35
  Bottom 0.406: LED20.A 126.57,56.72 112.6,56.72 R31.1
N$36
  Bottom 0.406: R32.1 109.22,50.8 114.98,50.8 115.03,50.76 116.11,50.76 116.16,50.8 LED21.A
N$37
  Bottom 0.406: R33.1 110.49,49.53 123.19,49.53 128.27,44.45 LED22.A
N$38
  Bottom 0.406: LED23.A 116.84,24.13 R34.1
N$39
  Bottom 0.406: LED24.A 121.92,21.59 R35.1
N$40  (via drill 0.9)
  Top 0.406: v62.23,74.93 64.77,72.39 66.04,72.39 77.47,60.96 101.6,60.96 109.22,68.58 109.22,69.85 113.03,73.66 130.16,73.66 130.28,73.79 131.34,73.79 131.46,73.66 132.08,73.66 133.35,74.93 133.35,78.74 133.38,78.74 134.65,80.01 137.75,80.01 139.02,78.74 v140.97,78.74
  Bottom 0.406: LED28.A 60.96,76.2 v62.23,74.93 | v140.97,78.74 IC1.23
N$41  (via drill 0.9)
  Top 0.406: v66.04,74.93 66.04,73.66 77.47,62.23 101.6,62.23 107.95,68.58 107.95,69.85 113.03,74.93 124.46,74.93 125.73,76.2 128.27,76.2 129.54,74.93 130.81,74.93 132.08,76.2 132.08,80.01 134.62,82.55 137.16,82.55 138.43,81.28 v140.97,81.28
  Bottom 0.406: LED27.A v66.04,74.93 | v140.97,81.28 IC1.24
N$42
  Bottom 0.356: LED26.A 87.63,72.39 120.65,72.39 | 138.24,83.82 IC1.25
  Bottom 0.406: 138.24,83.82 137.87,83.45 137.87,83.29 137.13,82.55 134.65,82.55 133.91,83.29 133.91,83.45 132.93,84.43 126.15,84.43 126.12,84.4 126.09,84.4 123.99,82.31 123.99,75.73 120.65,72.39
N$43
  Bottom 0.356: 121.7,74.73 123.25,76.28 123.25,82.61 125.81,85.17
  Bottom 0.406: IC1.26 142.24,85.09 134.65,85.09 134.55,85.19 125.83,85.19 125.81,85.17 | LED25.A 88.9,76.2 88.9,75.67 89.64,74.93 90.7,74.93 91.03,74.6 119.3,74.6 119.43,74.73 121.7,74.73
N$44
  Bottom 0.406: LED28.K 59.69,81.28 57.2,78.79 57.2,76.78 57.15,76.73 57.15,74.93 R39.2
N$45
  Bottom 0.406: R38.2 58.42,78.74 59.69,80.01 64.77,80.01 LED27.K
N$46
  Bottom 0.406: R37.2 88.9,73.66 LED26.K
N$47
  Bottom 0.406: R36.2 90.17,77.47 LED25.K
N$48  (via drill 0.9)
  Top 0.813: v76.2,69.85 77.78,71.42 77.78,83.82 77.78,84.12 78.44,84.78 79.8,84.78 80.72,85.71 80.72,87.07 v81.28,87.63
  Bottom 0.813: v76.2,69.85 JP1.1 | v81.28,87.63 80.01,88.9 X1.9
N$49
  Bottom 0.356: R4.1 114.82,97.47 S8.3
N$50
  Bottom 0.356: R41.1 99.58,97.47 S6.3
N$51
  Bottom 0.406: T9.3 16.51,48.43 LED9.K
N$52
  Bottom 0.356: R45.1 40.12,97.47 S2.4
N$53
  Bottom 0.406: LED1.K 65.51,69.32 65.51,68.75 64.24,67.48 T1.3
N$54
  Bottom 0.406: LED2.K 57.89,69.32 57.89,68.75 56.62,67.48 T2.3
N$55
  Bottom 0.406: LED3.K 50.27,69.32 50.27,68.75 49,67.48 T3.3
N$56
  Bottom 0.406: LED4.K 42.65,69.32 42.65,68.75 41.38,67.48 T4.3
N$57
  Bottom 0.406: LED5.K 35.03,69.32 35.03,68.75 33.76,67.48 T5.3
N$58
  Bottom 0.406: LED6.K 27.41,69.32 27.41,68.75 26.14,67.48 T6.3
N$59
  Bottom 0.406: T17.3 108.12,69.85 LED17.K
N$60
  Bottom 0.406: T10.3 16.51,40.81 LED10.K
N$61
  Bottom 0.406: T11.3 16.51,33.19 LED11.K
N$62
  Bottom 0.406: T12.3 16.51,30.31 LED12.K
N$63
  Bottom 0.406: T13.3 78.91,69.85 LED13.K
N$64
  Bottom 0.406: T14.3 85.26,69.85 LED14.K
N$65
  Bottom 0.406: LED7.K 17.78,64.77 17.78,62.4 T7.3
N$66
  Bottom 0.406: LED8.K 17.61,57.32 T8.3
N$67
  Bottom 0.406: T15.3 92.88,69.85 LED15.K
N$68
  Bottom 0.406: LED16.K 100.5,69.85 T16.3
N$69
  Bottom 0.406: T18.3 115.74,69.85 LED18.K
N$70
  Bottom 0.406: LED19.K 128.27,66.04 T19.3
N$71
  Bottom 0.406: T20.3 130.81,60.79 LED20.K
N$72
  Bottom 0.406: LED21.K 130.98,50.63 T21.3
N$73
  Bottom 0.406: LED22.K 130.98,43.01 T22.3
N$74
  Bottom 0.406: LED23.K 130.98,35.39 T23.3
N$75
  Bottom 0.406: LED24.K T24.3
N$76
  Bottom 0.356: R43.1 55.36,97.47 S4.4
N$77
  Bottom 0.356: R44.1 43.7,97.47 S3.3
N$78
  Bottom 0.356: R42.1 96,97.47 S5.4
N$79
  Bottom 0.356: R46.1 28.46,97.47 S1.3
N$80
  Bottom 0.356: R40.1 111.24,97.47 S7.4
RESET
  Bottom 0.406: R1.1 132.08,93.98 C1.1 IC1.1 139.7,91.44 141.53,89.61 141.53,88.37 142.27,87.63 144.75,87.63 145.49,86.89 145.49,85.65 148.75,82.39 148.75,44.62 SV1.5
RS  (via drill 0.9)
  Top 0.406: v105.41,13.97 111.76,20.32 111.76,46.52 116,50.76 116.11,50.76 116.88,51.53 116.88,53.35 v118.11,54.57
  Bottom 0.406: v118.11,54.57 129.5,54.57 133.35,58.42 IC1.14 | v105.41,13.97 U$1.4
RS232RX  (via drill 0.9)
  Top 0.406: v69.49,79.97 69.75,80.23 69.75,81.85 71.72,83.82 v76.2,83.82
  Bottom 0.406: IC2.14 104.74,85.72 102.76,87.71 94.87,87.71 91.69,84.53 84.9,84.53 83.7,85.72 80.64,85.72 JP2.6 v76.2,83.82 | v69.49,79.97 70.71,78.74 JP2.1
RS232RX_CON  (via drill 0.9)
  Top 0.406: X1.2 70.92,84.89 67.31,81.28 67.31,78.74 68.58,77.47 70.45,77.47 70.55,77.37 71.69,77.37 71.79,77.47 72.39,77.47 v73.66,76.2
  Bottom 0.406: v73.66,76.2 JP2.3
RS232TX
  Bottom 0.406: IC2.13 107.31,83.19 105.37,81.24 101.03,81.24 95.81,86.45 94.69,86.45 92.01,83.77 81.23,83.77 JP2.5 76.2,76.2 75.52,76.2 74.2,74.89 71.69,74.89 69.11,77.47 68.58,77.47 68.17,77.88 68.17,80.87 68.58,81.28 JP2.2
RS232TX_CON
  Bottom 0.356: X1.3 JP2.4
RW  (via drill 0.9)
  Top 0.406: v115.57,52.07 110.49,46.99 110.49,21.59 v102.87,13.97
  Bottom 0.406: IC1.15 142.05,58.42 136.21,52.58 119.05,52.58 118.97,52.5 117.25,52.5 117.17,52.58 116.08,52.58 v115.57,52.07 | v102.87,13.97 U$1.5
RXD
  Bottom 0.406: IC2.12 112.5,88.37 135.36,88.37 IC1.2
SCK
  Bottom 0.406: IC1.19 147.32,64.77 147.32,45.72 SV1.7
SCL  (via drill 0.9)
  Top 0.406: v34.29,82.55 33.02,81.28 29.21,81.28 IC4.14 7.14,62.23 v6.75,61.84 6.75,60.09 6.35,59.69 | 6.35,59.69 6.35,48.26 2.54,44.45 2.54,10.19 3.28,9.45 3.41,9.45 3.96,8.89 15.24,8.89 v16.51,7.62 17.19,7.62 18.51,8.93 19.59,8.93 20.36,8.16 20.36,7.08 20.28,7 20.28,6.39 24.13,2.54 113.03,2.54 125.73,15.24 130.19,15.24 130.27,15.16 131.35,15.16 131.43,15.24 v133.35,15.24 134.82,16.71 147.25,16.71 148.95,18.41 148.95,22.23 148.9,22.28 148.9,85.95 147.32,87.52 R11.1 | 6.35,59.69
  Bottom 0.406: IC1.28 146.05,91.44 147.32,90.17 R11.1 | IC3.14 35.56,83.82 v34.29,82.55 | v16.51,7.62 IC5.14 | v133.35,15.24 IC6.14
SDA  (via drill 0.9)
  Top 0.406: v19.05,7.62 17.74,6.31 10.2,6.31 8.38,8.13 3.49,8.13 1.27,10.35 1.27,44.45 5.08,48.26 5.08,63.5 v6.35,64.77 6.35,66.04 12.7,72.39 12.7,80.01 20.95,88.26 v30.48,88.26 | v130.81,16.47 131.81,17.48 146.93,17.48 148.18,18.73 148.18,21.91 148.13,21.97 148.13,72.96 146.05,75.04 146.05,76.09 148.13,78.17 148.13,84.91 R10.1
  Bottom 0.406: R10.1 147.32,86.36 144.78,88.9 IC1.27 | IC5.15 v19.05,7.62 19.05,5.08 22.86,1.27 136.42,1.27 137.16,2.01 137.16,3.07 136.42,3.81 135.36,3.81 135.31,3.76 130.86,3.76 129.54,5.08 129.54,10.16 130.81,11.43 IC6.15 v130.81,16.47 | v6.35,64.77 7.62,64.77 IC4.15 | v30.48,88.26 v30.49,88.26 IC3.15
TXD
  Bottom 0.406: IC1.3 122.57,86.36 122.48,86.45 121.36,86.45 118.65,83.74 114.41,83.74 112.43,85.72 IC2.11

### Text on the board
Top: S1 | S2 | S3 | S4 | S5 | S6 | S7 | S8 | LSD-1-DSP-D-T
Bottom: LSD-1-DSP-D-B
tStop: LSD-1-DSP-D-TSTOP
bStop: LSD-1-DSP-D-BSTOP